# EasyEDA Pro project MSDriver(Ver2.0).eprj

# Schematic Schematic1
Board Name: Board1; Create Date: 2025-01-27; Page Name: P1; Project Name: MSDriver(Ver2.0); Schematic Name: Schematic1; Update Date: 2025-03-01; Company: 嘉立创EDA; Page Size: A4; Version: V1.0
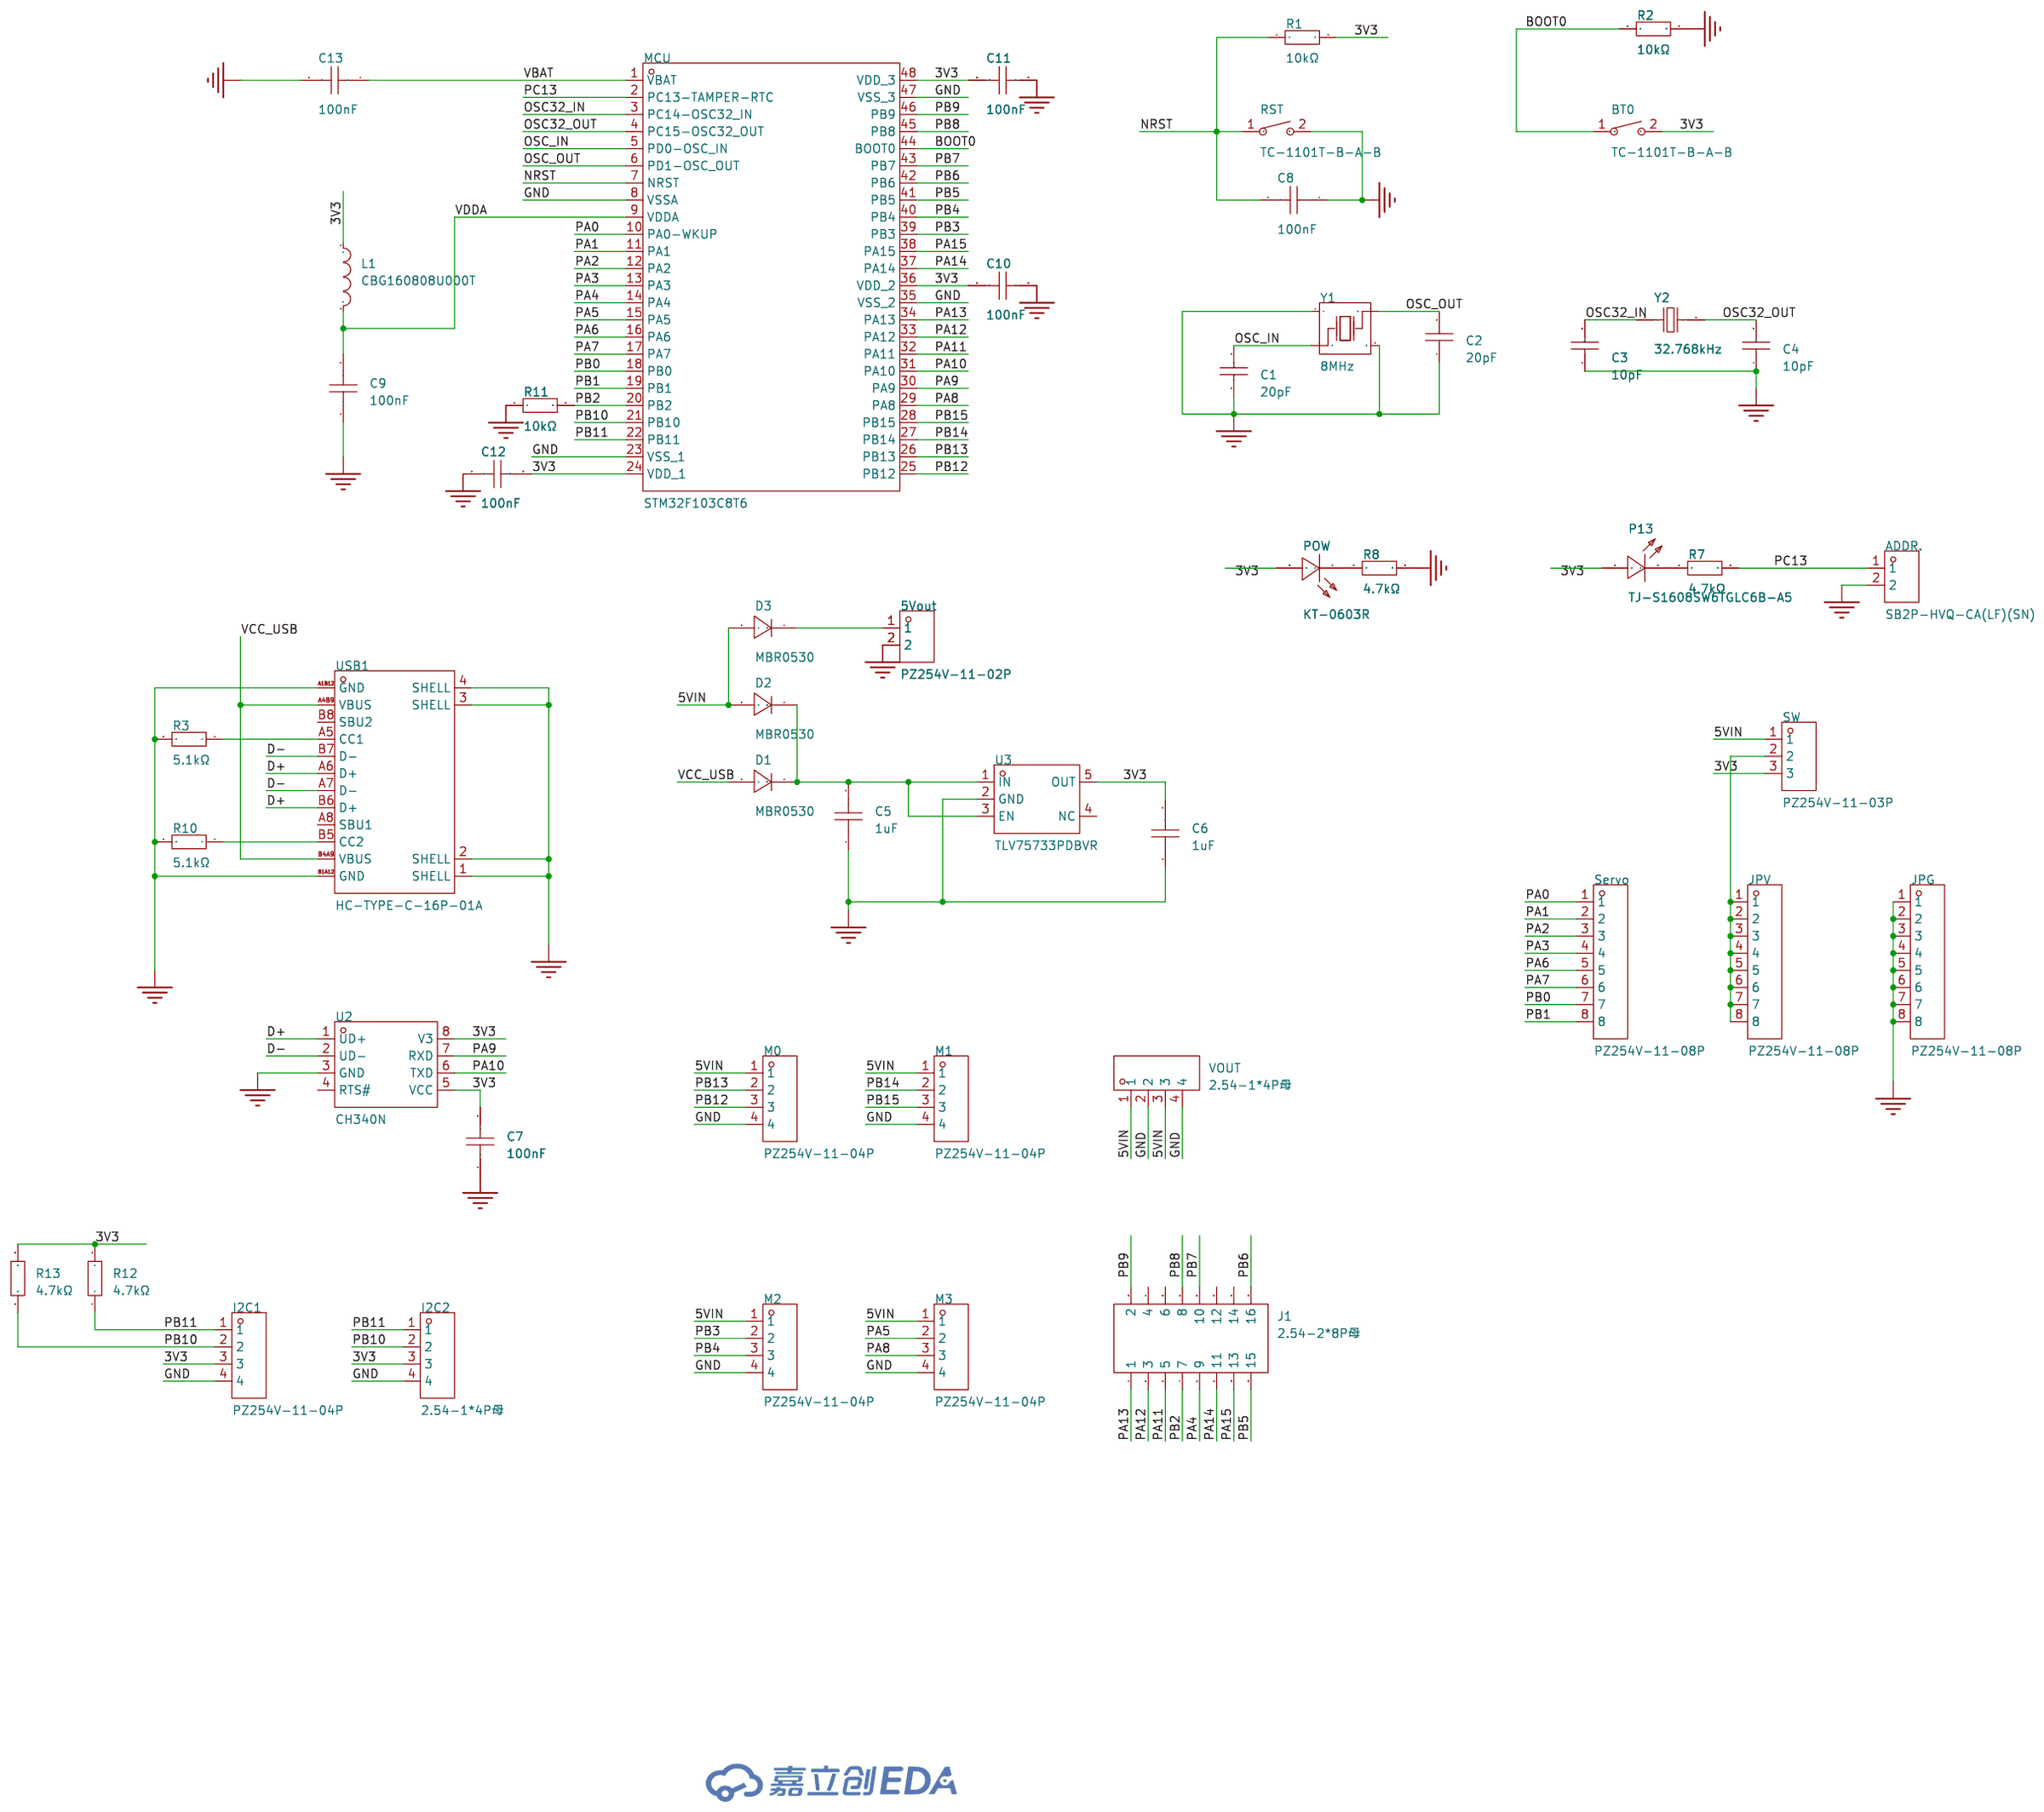
[diagram p0: schematic sheet]

## Parts
5Vout  PZ254V-11-02P  [HDR-TH_2P-P2.54-V-M]
ADDR.  SB2P-HVQ-CA(LF)(SN)  [HDR-TH_2P-P2.54-V-M-1]
BT0  TC-1101T-B-A-B  [KEY-TH_2P-L6.0-W3.5-P6.50]
C1  20pF  [C0603]
C2  20pF  [C0603]
C3  10pF  [C0603]
C4  10pF  [C0603]
C5  1uF  [C0603]
C6  1uF  [C0603]
C7  100nF  [C0603]
C8  100nF  [C0603]
C9  100nF  [C0603]
C10  100nF  [C0603]
C11  100nF  [C0603]
C12  100nF  [C0603]
C13  100nF  [C0603]
D1  MBR0530  [SOD-123_L2.8-W1.8-LS3.7-RD]
D2  MBR0530  [SOD-123_L2.8-W1.8-LS3.7-RD]
D3  MBR0530  [SOD-123_L2.8-W1.8-LS3.7-RD]
I2C1  PZ254V-11-04P  [HDR-TH_4P-P2.54-V-M]
I2C2  2.54-1*4P母  [HDR-TH_4P-P2.54-V-F]
J1  2.54-2*8P母  [HDR-TH_16P-P2.54-V-F-R2-C8-S2.54]
JPG  PZ254V-11-08P  [HDR-TH_8P-P2.54-V-M]
JPV  PZ254V-11-08P  [HDR-TH_8P-P2.54-V-M]
L1  CBG160808U000T  [L0603]
M0  PZ254V-11-04P  [HDR-TH_4P-P2.54-V-M]
M1  PZ254V-11-04P  [HDR-TH_4P-P2.54-V-M]
M2  PZ254V-11-04P  [HDR-TH_4P-P2.54-V-M]
M3  PZ254V-11-04P  [HDR-TH_4P-P2.54-V-M]
MCU  STM32F103C8T6  [LQFP-48_L7.0-W7.0-P0.50-LS9.0-BL]
P13  TJ-S1608SW6TGLC6B-A5  [LED0603-R-RD_BLUE]
POW  KT-0603R  [LED0603-RD]
R1  10kΩ  [R0603]
R2  10kΩ  [R0603]
R3  5.1kΩ  [R0603]
R7  4.7kΩ  [R0603]
R8  4.7kΩ  [R0603]
R10  5.1kΩ  [R0603]
R11  10kΩ  [R0603]
R12  4.7kΩ  [R1206]
R13  4.7kΩ  [R1206]
RST  TC-1101T-B-A-B  [KEY-TH_2P-L6.0-W3.5-P6.50]
Servo  PZ254V-11-08P  [HDR-TH_8P-P2.54-V-M]
SW  PZ254V-11-03P  [HDR-TH_3P-P2.54-V-M]
U2  CH340N  [SOP-8_L4.9-W3.9-P1.27-LS6.0-BL]
U3  TLV75733PDBVR  [SOT-23-5_L2.9-W1.6-P0.95-LS2.8-BL]
USB1  HC-TYPE-C-16P-01A  [USB-C-SMD_HC-TYPE-C-16P-01A]
VOUT  2.54-1*4P母  [HDR-TH_4P-P2.54-V-F]
Y1  8MHz  [CRYSTAL-SMD_4P-L3.2-W2.5-BL]
Y2  32.768kHz  [FC-135R_L3.2-W1.5]

## Library data of the parts
5Vout = PZ254V-11-02P: LCSC Part Name: 间距:2.54mm 1x2P 直插 方针; Supplier Part: C492401; Manufacturer: XFCN(兴飞); Supplier Footprint: 插件,P=2.54mm; JLCPCB Part Class: 扩展库; Datasheet: https://atta.szlcsc.com/upload/public/pdf/source/20200309/C492401_A812433581A9B211A7FFA413ADDFF0E5.pdf; Supplier: LCSC; Pin Structure: 1x2P; Pitch: 2.54mm; Circluar Pins/Square Pins: 方针; Mounting Type: 直插; Number of Rows: 单排; Number of Pins: 2P; Length of Mating Pin: 6mm; Insulation Height: 2.5mm; Length of End Connection Pin: 3mm; Contact Material: 黄铜; Operating Temperature Range: -40℃~+105℃; Color: 黑色
ADDR. = SB2P-HVQ-CA(LF)(SN): LCSC Part Name: 间距:2.5mm 1x2P 直插; Supplier Part: C157909; Manufacturer: JST; Supplier Footprint: 插件,P=2.5mm; JLCPCB Part Class: 扩展库; Datasheet: https://atta.szlcsc.com/upload/public/pdf/source/20180319/2518302FDF705D922213CC841EAA9FB0.pdf; Supplier: LCSC; Pin Structure: 1x2P; Pitch: 2.5mm; Mounting Type: 直插; Number of Rows: 单排; Number of Pins: 2P; Length of Mating Pin: 7.5mm; Insulation Height: 3.3mm; Length of End Connection Pin: 3.4mm; Contact Material: 黄铜; Operating Temperature Range: -25℃~+85℃; Color: 白色
BT0 RST = TC-1101T-B-A-B: LCSC Part Name: 6*3.5*4.3mm 直插 轻触开关; Supplier Part: C500069; Manufacturer: XKB Connectivity(中国星坤); Supplier Footprint: 插件; JLCPCB Part Class: 扩展库; Datasheet: https://atta.szlcsc.com/upload/public/pdf/source/20211011/B69A8CD93B4DADD1FF98516D35420DE2.pdf; Supplier: LCSC; Circuit: 单刀单掷; Actuator Style: 矩形按钮; Operating Force: 160gf; Mounting Style: 直插; Switch Length: 6mm; Switch Width: 3.5mm; Switch Height: 4.3mm; Strike Gundam: 不带; Contact Current: 50mA; Voltage Rating (DC): 12V; Actuator/Cap Color: 黑色; With Lamp: 无; Pin Style: PC引脚; Mechanical Life: 5万次; Operating Temperature: -20℃~+70℃
C1 C2 = CL10C200JB8NNNC: LCSC Part Name: 20pF ±5% 50V; Supplier Part: C1648; Manufacturer: SAMSUNG(三星); Supplier Footprint: 0603; JLCPCB Part Class: 基础库; Datasheet: https://atta.szlcsc.com/upload/public/pdf/source/20160218/1457707763339.pdf; Supplier: LCSC; Tolerance: ±5%; Voltage Rated: 50V; Temperature Coefficient: C0G
C3 C4 = CL10C100JB8NNNC: LCSC Part Name: 10pF ±5% 50V; Supplier Part: C1634; Manufacturer: SAMSUNG(三星); Supplier Footprint: 0603; JLCPCB Part Class: 基础库; Datasheet: https://atta.szlcsc.com/upload/public/pdf/source/20160218/1457707763339.pdf; Supplier: LCSC; Tolerance: ±5%; Voltage Rated: 50V; Temperature Coefficient: C0G
C5 C6 = CL10A105KB8NNNC: LCSC Part Name: 1uF ±10% 50V; Supplier Part: C15849; Manufacturer: SAMSUNG(三星); Supplier Footprint: 0603; JLCPCB Part Class: 基础库; Datasheet: https://atta.szlcsc.com/upload/public/pdf/source/20160218/1457707763339.pdf; Supplier: LCSC; Tolerance: ±10%; Voltage Rated: 50V; Temperature Coefficient: X5R
C7-C13 = CGA0603X7R104K500JT: LCSC Part Name: 100nF ±10% 50V; Supplier Part: C6119867; Manufacturer: HRE(芯声); Supplier Footprint: 0603; JLCPCB Part Class: 扩展库; Supplier: LCSC; Tolerance: ±10%; Voltage Rated: 50V; Temperature Coefficient: X7R
D1-D3 = MBR0530_C77336: LCSC Part Name: 电压:30V 电流:500mA; Supplier Part: C77336; Manufacturer: CJ(江苏长电/长晶); Supplier Footprint: SOD-123; JLCPCB Part Class: 扩展库; Datasheet: https://atta.szlcsc.com/upload/public/pdf/source/20160702/1467448303432.pdf; Supplier: LCSC; Forward Voltage (Vf@If): 550mV@500mA; Reverse Voltage (Vr): 30V; Rectified Current: 500mA
I2C1 M0-M3 = PZ254V-11-04P: LCSC Part Name: 间距:2.54mm 1x4P 直插 方针; Supplier Part: C2691448; Manufacturer: XFCN(兴飞); Supplier Footprint: 插件,P=2.54mm; JLCPCB Part Class: 扩展库; Datasheet: https://atta.szlcsc.com/upload/public/pdf/source/20200309/C492403_F9F19131791D08044AD4F84F8E751A34.pdf; Supplier: LCSC; Pin Structure: 1x4P; Pitch: 2.54mm; Circluar Pins/Square Pins: 方针; Mounting Type: 直插; Number of Rows: 单排; Number of Pins: 4P; Current Rating (Max): 3A; Voltage Rating (Max): 250V; Length of Mating Pin: 6mm; Insulation Height: 2.5mm; Length of End Connection Pin: 3mm; Operating Temperature Range: -40℃~+105℃; Color: 黑色
I2C2 VOUT = 2.54-1*4P母: LCSC Part Name: 间距:2.54mm 1x4P 直插; Supplier Part: C2718488; Manufacturer: BOOMELE(博穆精密); Supplier Footprint: 插件,P=2.54mm; JLCPCB Part Class: 扩展库; Datasheet: https://atta.szlcsc.com/upload/public/pdf/source/20210301/C2718488_F4427B881E42CAA8DDB0B1C12B3A522C.pdf; Supplier: LCSC; Holes Structure: 1x4P; Pitch: 2.54mm; Circular Hole / Square Hole: 方孔; Mounting Type: 直插; Number of Rows: 单排; Number of Holes: 4P; Current Rating (Max): 3A; Holes Direction: 顶部; Contact Material: 青铜; Operating Temperature Range: -40℃~+105℃
J1 = 2.54-2*8P母: LCSC Part Name: 间距:2.54mm 2x8P 直插; Supplier Part: C30734; Manufacturer: BOOMELE(博穆精密); Supplier Footprint: 插件,P=2.54mm; JLCPCB Part Class: 扩展库; Datasheet: https://atta.szlcsc.com/upload/public/pdf/source/20230817/400B44B2F3F98035DBB6B63900A9163B.pdf; Supplier: LCSC; Holes Structure: 2x8P; Pitch: 2.54mm; Row Spacing: 2.54mm; Mounting Type: 直插; Number of Rows: 双排; Number of Holes: 16P; Contact Material: 黄铜
JPG JPV Servo = PZ254V-11-08P: LCSC Part Name: 间距:2.54mm 1x8P 直插 方针; Supplier Part: C492407; Manufacturer: XFCN(兴飞); Supplier Footprint: 插件,P=2.54mm; JLCPCB Part Class: 扩展库; Datasheet: https://atta.szlcsc.com/upload/public/pdf/source/20200309/C492407_83A6FB26A2233368EDB9516968EC6149.pdf; Supplier: LCSC; Pin Structure: 1x8P; Pitch: 2.54mm; Circluar Pins/Square Pins: 方针; Mounting Type: 直插; Number of Rows: 单排; Number of Pins: 8P; Length of Mating Pin: 6mm; Insulation Height: 2.5mm; Length of End Connection Pin: 3mm; Contact Material: 黄铜; Operating Temperature Range: -40℃~+105℃; Color: 黑色
L1 = CBG160808U000T: LCSC Part Name: 单路 0603磁珠 阻抗0Ω@100MHz; Supplier Part: C43163; Manufacturer: FH(风华); Supplier Footprint: 0603; JLCPCB Part Class: 扩展库; Datasheet: https://atta.szlcsc.com/upload/public/pdf/source/20190129/C361667_1614D407CC98D1D3CFBD9E1F7511C14D.pdf; Supplier: LCSC; Impedance @ Frequency: 0Ω@100MHz; DC Resistance: 100mΩ; Current Rating: 800mA; Circuits: 1
MCU = STM32F103C8T6: LCSC Part Name: 主流增强型ARM Cortex-M3 MCU，具有64 KB Flash、72 MHz CPU、电机控制、USB和CAN; Supplier Part: C8734; Manufacturer: ST(意法半导体); Supplier Footprint: LQFP-48(7x7); JLCPCB Part Class: 扩展库; Datasheet: https://atta.szlcsc.com/upload/public/pdf/source/20220812/8363ACEC51AD55ECEB84799464F7CB85.pdf; Supplier: LCSC; CPU Core: ARM-M3; CPU Maximum Speed: 72MHz; Program Storage Size: 64KB; Program Memory Type: FLASH; Number of I/O: 37; ADC (Bit): 12bit; Low Voltage Detection Threshold: 2V~3.6V
P13 = TJ-S1608SW6TGLC6B-A5: LCSC Part Name: 蓝灯; Supplier Part: C192317; Manufacturer: TOGIALED(统佳); Supplier Footprint: 0603; JLCPCB Part Class: 扩展库; Datasheet: https://atta.szlcsc.com/upload/public/pdf/source/20180531/C192317_AA13A08FB08D946F89A6CA6E91343921.pdf; Supplier: LCSC; Emitted Color: 蓝色; Power Dissipation: 111mW; Forward Current: 20mA; Dominant Wavelength: 460nm; Peak Wavelength: 465nm; Lens Color: 无色透明透镜; Viewing Angle: 120°; Operating Temperature: -40℃~+80℃
POW = KT-0603R: LCSC Part Name: 0603 红灯 高亮; Supplier Part: C2286; Manufacturer: KENTO; Supplier Footprint: 0603; JLCPCB Part Class: 基础库; Datasheet: https://atta.szlcsc.com/upload/public/pdf/source/20160616/1466072038404.pdf; Supplier: LCSC; Emitted Color: 红色; Operating Temperature: -40℃~+85℃
R1 R2 R11 = 0603WAF1002T5E: LCSC Part Name: 厚膜电阻 10kΩ ±1% 100mW; Supplier Part: C25804; Manufacturer: UNI-ROYAL(厚声); Supplier Footprint: 0603; JLCPCB Part Class: Basic Part; Datasheet: https://atta.szlcsc.com/upload/public/pdf/source/20200306/C422600_1E6D84923E4A46A82E41ADD87F860B5C.pdf; Supplier: LCSC; Type: 厚膜电阻; Tolerance: ±1%; Power(Watts): 100mW; Overload Voltage (Max): 75V; Temperature Coefficient: ±100ppm/℃; Operating Temperature Range: -55℃~+155℃
R3 R10 = 0603WAF5101T5E: LCSC Part Name: 5.1kΩ ±1% 100mW 厚膜电阻; Supplier Part: C23186; Manufacturer: UNI-ROYAL(厚声); Supplier Footprint: 0603; JLCPCB Part Class: Basic Part; Datasheet: https://atta.szlcsc.com/upload/public/pdf/source/20200306/C422600_1E6D84923E4A46A82E41ADD87F860B5C.pdf; Supplier: LCSC; Type: 厚膜电阻; Tolerance: ±1%; Power(Watts): 100mW; Overload Voltage (Max): 75V; Temperature Coefficient: ±100ppm/℃; Operating Temperature Range: -55℃~+155℃
R7 R8 = 0603WAF4701T5E: LCSC Part Name: 4.7kΩ ±1% 100mW 厚膜电阻; Supplier Part: C23162; Manufacturer: UNI-ROYAL(厚声); Supplier Footprint: 0603; JLCPCB Part Class: Basic Part; Datasheet: https://atta.szlcsc.com/upload/public/pdf/source/20200306/C422600_1E6D84923E4A46A82E41ADD87F860B5C.pdf; Supplier: LCSC; Type: 厚膜电阻; Tolerance: ±1%; Power(Watts): 100mW; Overload Voltage (Max): 75V; Temperature Coefficient: ±100ppm/℃; Operating Temperature Range: -55℃~+155℃
R12 R13 = 1206W4F4701T5E: LCSC Part Name: 4.7kΩ ±1% 250mW 厚膜电阻; Supplier Part: C17936; Manufacturer: UNI-ROYAL(厚声); Supplier Footprint: 1206; JLCPCB Part Class: 基础库; Datasheet: https://atta.szlcsc.com/upload/public/pdf/source/20200306/C422600_1E6D84923E4A46A82E41ADD87F860B5C.pdf; Supplier: LCSC; Type: 厚膜电阻; Tolerance: ±1%; Power(Watts): 250mW; Overload Voltage (Max): 200V; Temperature Coefficient: ±100ppm/℃; Operating Temperature Range: -55℃~+155℃
SW = PZ254V-11-03P: LCSC Part Name: 间距:2.54mm 1x3P 直插 方针; Supplier Part: C2937625; Manufacturer: XFCN(兴飞); Supplier Footprint: 插件,P=2.54mm; JLCPCB Part Class: 扩展库; Datasheet: https://atta.szlcsc.com/upload/public/pdf/source/20200309/C492402_8335C3D49C4E4C618838D59BB1D024C1.pdf; Supplier: LCSC; Pin Structure: 1x3P; Pitch: 2.54mm; Circluar Pins/Square Pins: 方针; Mounting Type: 直插; Number of Rows: 单排; Number of Pins: 3P; Current Rating (Max): 3A; Voltage Rating (Max): 250V; Length of Mating Pin: 6mm; Insulation Height: 2.5mm; Length of End Connection Pin: 3mm; Operating Temperature Range: -40℃~+105℃; Color: 黑色
U2 = CH340N: LCSC Part Name: USB转串口芯片CH340; Supplier Part: C2977777; Manufacturer: WCH(南京沁恒); Supplier Footprint: SOP-8; JLCPCB Part Class: 扩展库; Datasheet: https://atta.szlcsc.com/upload/public/pdf/source/20240313/115CDE92081B1D6CB446704AD5D0F5F2.pdf; Supplier: LCSC; Applications Function: USB转串口; Protocol: USB 2.0; Number of Channels: 1; Supply Voltage: 3.3V；5V; Data Rate: 2Mbps; Operating Temperature: -20℃~+70℃
U3 = TLV75733PDBVR: LCSC Part Name: 具有使能功能的 1A、低 IQ、高精度、低压降稳压器; Supplier Part: C485517; Manufacturer: TI(德州仪器); Supplier Footprint: SOT-23-5; JLCPCB Part Class: 扩展库; Datasheet: https://www.ti.com/cn/lit/gpn/tlv757p; Supplier: LCSC; Output Type: 固定; Maximum Input Voltage: 5.5V; Output Voltage: 3.3V; Output Current: 1A; Power Supply Rejection Ratio (PSRR): 52dB; Dropout Voltage: 475mV@(1A); Feature: 防静电保护；浪涌保护；低ESR；热保护(TSD)；欠压闭锁；过流保护(OCP)；带使能; Operating Temperature: -40℃~+125℃@(Tj); Output Polarity: 正极; Number of Outputs: 1
USB1 = HC-TYPE-C-16P-01A: LCSC Part Name: Type-C 母 卧贴; Supplier Part: C2894897; Manufacturer: HCTL(华灿天禄); Supplier Footprint: SMD; JLCPCB Part Class: 扩展库; Datasheet: https://atta.szlcsc.com/upload/public/pdf/source/20221116/CF1C0058359F0761D6F7BB69303000BD.pdf; Supplier: LCSC; Connector Type: Type-C; Gender: 母; Mounting Style: 卧贴; Number of Contacts: 16P; Number of Ports: 1; Current Rating - Power (Max): 5A; Contact Material: 铜; Contact Plating: 金; Operating Temperature Range: -55℃~+85℃; Soldering Temperature(Max): 260℃
Y1 = TAXM8M4RDBCCT2T: LCSC Part Name: 8MHz ±10ppm 10pF; Supplier Part: C400090; Manufacturer: YJX(雅晶鑫); Supplier Footprint: SMD3225-4P; JLCPCB Part Class: 扩展库; Datasheet: https://atta.szlcsc.com/upload/public/pdf/source/20190626/C400090_CF95B89E745AFE4EF2E392EF8AC009D6.pdf; Supplier: LCSC; Crystal Type: 贴片晶振; Normal temperature Frequency Tolerance: ±10ppm; Load Capacitor: 10pF; Frequency Stability(Full temperature range): ±15ppm; Equivalent Series Resistance (ESR): 250Ω; Operating Temperature: -40℃~+85℃
Y2 = Q13FC13500004_C32346: LCSC Part Name: 32.768kHz ±20ppm 12.5pF; Supplier Part: C32346; Manufacturer: EPSON(爱普生); Manufacturer Part: Q13FC13500004; Supplier Footprint: SMD3215-2P; JLCPCB Part Class: 基础库; Datasheet: https://atta.szlcsc.com/upload/public/pdf/source/20240418/0E0FF5F0356BA3753F616001439D1416.pdf; Supplier: LCSC; Crystal Type: 贴片晶振; Normal temperature Frequency Tolerance: ±20ppm; Load Capacitor: 12.5pF; Equivalent Series Resistance (ESR): 70kΩ; Operating Temperature: -40℃~+85℃

## Nets
3V3: BT0.2 C6.2 C7.2 C10.1 C11.1 C12.2 I2C1.3 I2C2.3 L1.1 MCU.24(VDD_1) MCU.36(VDD_2) MCU.48(VDD_3) P13.1(A) POW.2(A) R1.2 R12.2 R13.2 SW.3 U2.5(VCC) U2.8(V3) U3.5(OUT)
5VIN: D2.2(A) D3.2(A) M0.1 M1.1 M2.1 M3.1 SW.1 VOUT.1 VOUT.3
GND: 5Vout.2 ADDR..2 C1.1 C2.1 C3.1 C4.1 C5.1 C6.1 C7.1 C8.1 C9.1 C10.2 C11.2 C12.1 C13.2 I2C1.4 I2C2.4 JPG.1 JPG.2 JPG.3 JPG.4 JPG.5 JPG.6 JPG.7 JPG.8 M0.4 M1.4 M2.4 M3.4 MCU.8(VSSA) MCU.23(VSS_1) MCU.35(VSS_2) MCU.47(VSS_3) R2.2 R3.2 R8.2 R10.2 R11.1 RST.2 U2.3(GND) U3.2(GND) USB1.1(SHELL) USB1.2(SHELL) USB1.3(SHELL) USB1.4(SHELL) USB1.A1B12(GND) USB1.B1A12(GND) VOUT.2 VOUT.4 Y1.2 Y1.4
VBAT: C13.1 MCU.1(VBAT)
VCC_USB: D1.2(A) USB1.A4B9(VBUS) USB1.B4A9(VBUS)
VDDA: C9.2 L1.2 MCU.9(VDDA)
BOOT0: BT0.1 MCU.44(BOOT0) R2.1
D+: U2.1(UD+) USB1.A6(D+) USB1.B6(D+)
D-: U2.2(UD-) USB1.A7(D-) USB1.B7(D-)
NRST: C8.2 MCU.7(NRST) R1.1 RST.1
OSC32_IN: C3.2 MCU.3(PC14-OSC32_IN) Y2.1
OSC32_OUT: C4.2 MCU.4(PC15-OSC32_OUT) Y2.2
OSC_IN: C1.2 MCU.5(PD0-OSC_IN) Y1.1
OSC_OUT: C2.2 MCU.6(PD1-OSC_OUT) Y1.3
PA0: MCU.10(PA0-WKUP) Servo.1
PA1: MCU.11(PA1) Servo.2
PA2: MCU.12(PA2) Servo.3
PA3: MCU.13(PA3) Servo.4
PA4: J1.9 MCU.14(PA4)
PA5: M3.2 MCU.15(PA5)
PA6: MCU.16(PA6) Servo.5
PA7: MCU.17(PA7) Servo.6
PA8: M3.3 MCU.29(PA8)
PA9: MCU.30(PA9) U2.7(RXD)
PA10: MCU.31(PA10) U2.6(TXD)
PA11: J1.5 MCU.32(PA11)
PA12: J1.3 MCU.33(PA12)
PA13: J1.1 MCU.34(PA13)
PA14: J1.11 MCU.37(PA14)
PA15: J1.13 MCU.38(PA15)
PB0: MCU.18(PB0) Servo.7
PB1: MCU.19(PB1) Servo.8
PB2: J1.7 MCU.20(PB2) R11.2
PB3: M2.2 MCU.39(PB3)
PB4: M2.3 MCU.40(PB4)
PB5: J1.15 MCU.41(PB5)
PB6: J1.16 MCU.42(PB6)
PB7: J1.10 MCU.43(PB7)
PB8: J1.8 MCU.45(PB8)
PB9: J1.2 MCU.46(PB9)
PB10: I2C1.2 I2C2.2 MCU.21(PB10) R13.1
PB11: I2C1.1 I2C2.1 MCU.22(PB11) R12.1
PB12: M0.3 MCU.25(PB12)
PB13: M0.2 MCU.26(PB13)
PB14: M1.2 MCU.27(PB14)
PB15: M1.3 MCU.28(PB15)
PC13: ADDR..1 MCU.2(PC13-TAMPER-RTC) R7.2
$1N3000: C5.2 D1.1(C) D2.1(C) U3.1(IN) U3.3(EN)
$1N4992: POW.1(K) R8.1
$1N5076: P13.2(K) R7.1
$1N6359: R10.1 USB1.B5(CC2)
$1N6363: R3.1 USB1.A5(CC1)
$1N11196: JPV.1 JPV.2 JPV.3 JPV.4 JPV.5 JPV.6 JPV.7 JPV.8 SW.2
$1N25739: 5Vout.1 D3.1(C)

Not connected (* = marked no-connect by the designer): J1 4 6 12 14; U2 4(RTS#); U3 4(NC); USB1 A8(SBU1) B8(SBU2)

# Board PCB2.1
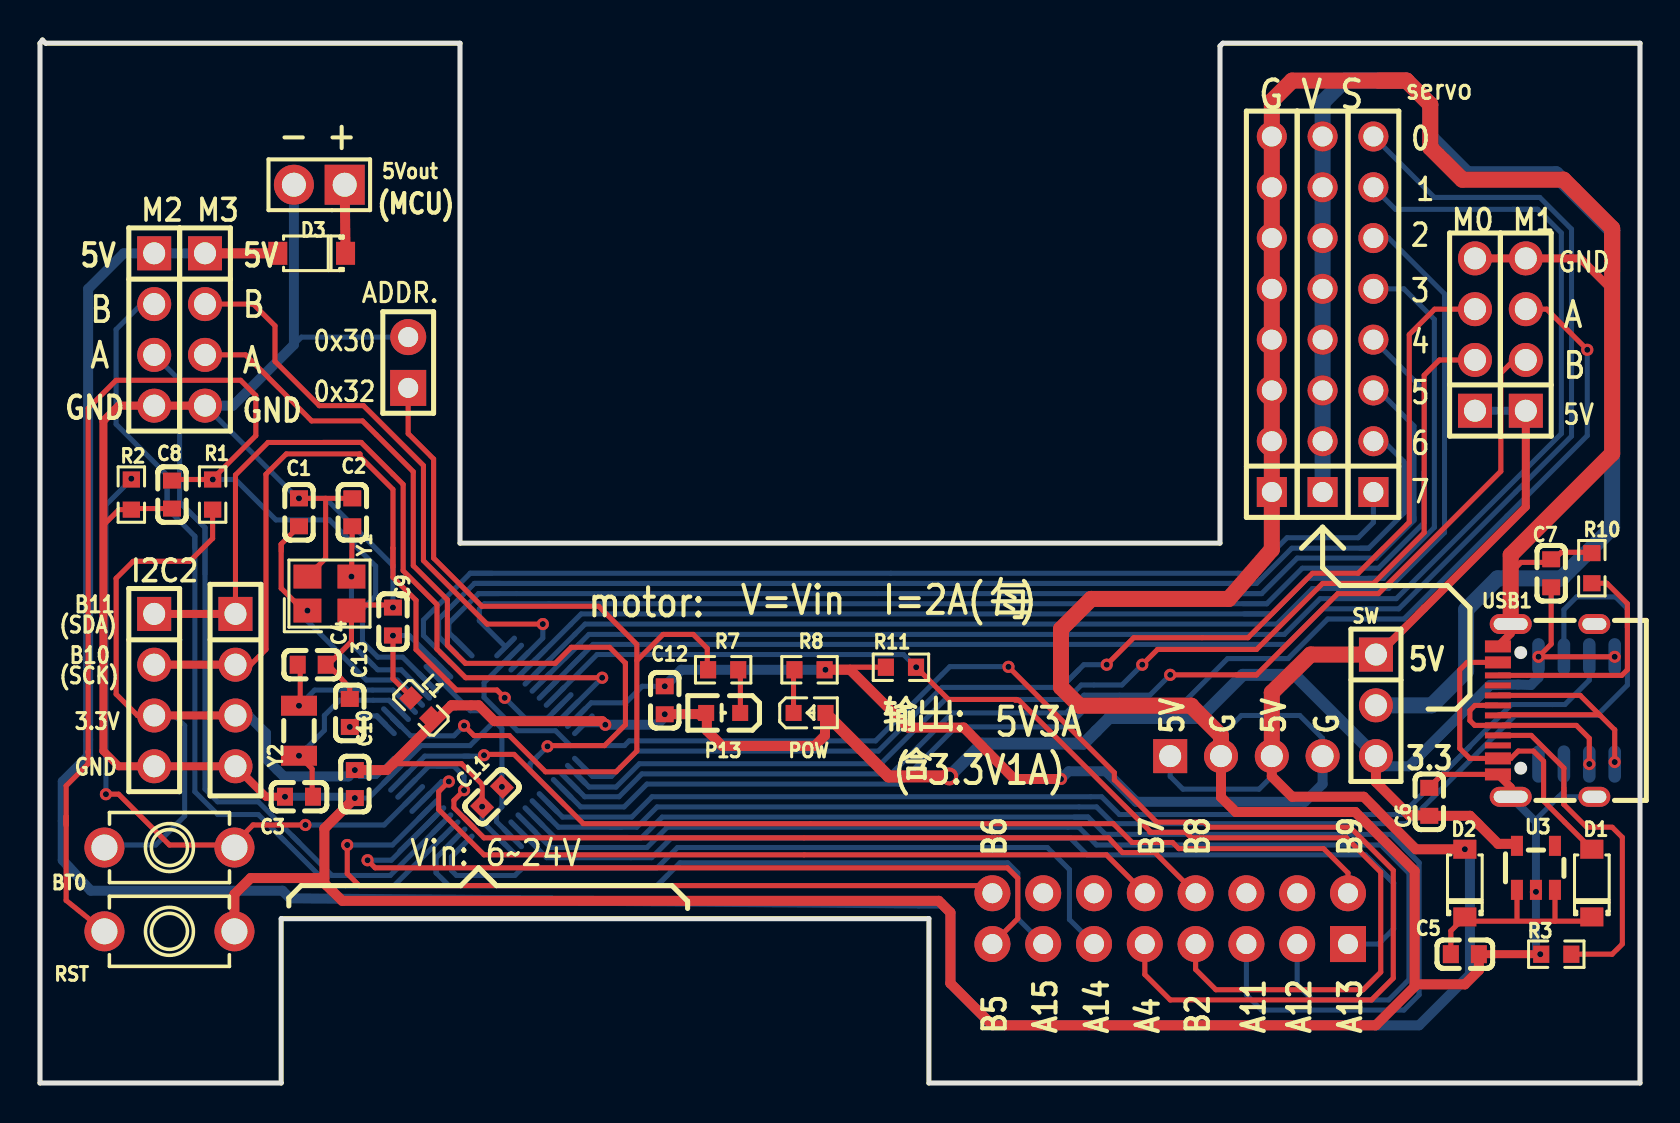
[diagram p1: board, top side]
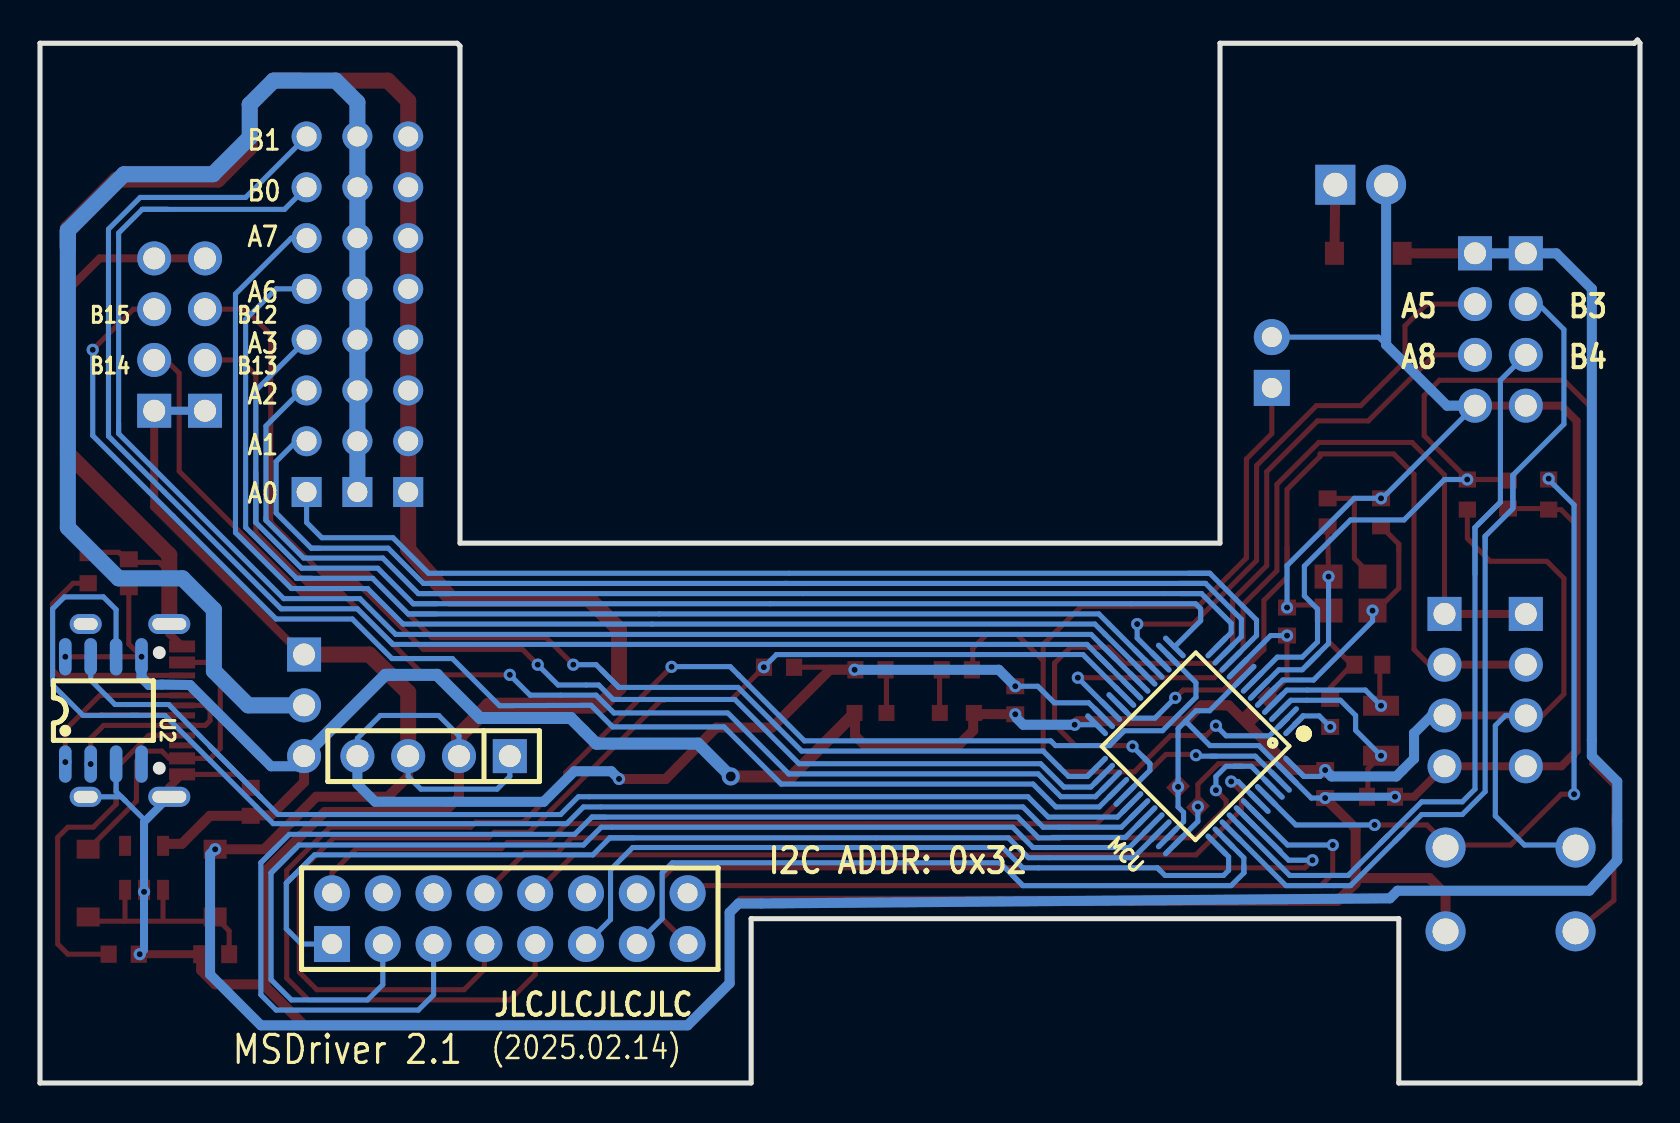
[diagram p2: board, bottom side, seen from below]

Outline 80 x 52.16 mm; copper layers: Top Layer, Bottom Layer. Coordinates in mm from the lower left corner of the outline.
Outline path: 0,52 0,0 12.06,0 12.06,8.22 44.44,8.22 44.44,0 80,0 80,52 59.14,52 59,51.86 59,27 21,27 21,52 0.28,52 0.12,52.16 0,52
Stack: Top Layer 0.035mm / Dielectric1 1.51mm FR4 er 4.5 / Bottom Layer 0.035mm

## Design rules (mm)
template: JLCPCB Capability(Two Layers Board)
spacing copperThickness1oz (default): track to track 0.102, other pairs 0.152 to 0.3
spacing copperThickness2oz: track to track 0.203, other pairs 0.152 to 0.3
track width copperThickness1oz (default): min 0.127, default 0.254, max 2.54
track width copperThickness2oz: min 0.203, default 0.254, max 2.54
differential pair differentialPair (default): width min 0.127, default 0.254, max 2.54; gap min 0.152, default 0.152
via viaSize (default): diameter min 0.5, default 0.61, max 10; hole min 0.3, default 0.305, max 6.3

## Placement (name value [footprint] x y rotation side)
5Vout  PZ254V-11-02P  [HDR-TH_2P-P2.54-V-M]  13.97 44.92 180 top
ADDR.  SB2P-HVQ-CA(LF)(SN)  [HDR-TH_2P-P2.54-V-M-1]  18.41 36.03 90 top
BT0  TC-1101T-B-A-B  [KEY-TH_2P-L6.0-W3.5-P6.50]  6.47 11.78 180 top
C1  20pF  [C0603]  12.95 28.54 270 top
C2  20pF  [C0603]  15.62 28.54 270 top
C3  10pF  [C0603]  12.95 14.32 0 top
C4  10pF  [C0603]  13.58 20.92 180 top
C5  1uF  [C0603]  71.24 6.44 180 top
C6  1uF  [C0603]  69.46 14.06 270 top
C7  100nF  [C0603]  75.56 25.49 270 top
C8  100nF  [C0603]  6.6 29.43 90 top
C9  100nF  [C0603]  17.65 23.08 270 top
C10  100nF  [C0603]  15.74 14.95 270 top
C11  100nF  [C0603]  22.6 14.32 45 top
C12  100nF  [C0603]  31.24 19.14 270 top
C13  100nF  [C0603]  15.49 18.51 90 top
D1  MBR0530  [SOD-123_L2.8-W1.8-LS3.7-RD]  77.59 10 90 top
D2  MBR0530  [SOD-123_L2.8-W1.8-LS3.7-RD]  71.24 10 90 top
D3  MBR0530  [SOD-123_L2.8-W1.8-LS3.7-RD]  13.58 41.49 180 top
I2C1  PZ254V-11-04P  [HDR-TH_4P-P2.54-V-M]  5.71 19.65 270 top
I2C2  2.54-1*4P母  [HDR-TH_4P-P2.54-V-F]  9.77 19.65 270 top
J1  2.54-2*8P母  [HDR-TH_16P-P2.54-V-F-R2-C8-S2.54]  56.51 8.22 180 bottom
JPG  PZ254V-11-08P  [HDR-TH_8P-P2.54-V-M]  61.59 38.45 90 top
JPV  PZ254V-11-08P  [HDR-TH_8P-P2.54-V-M]  64.13 38.45 90 top
L1  CBG160808U000T  [L0603]  19.04 18.76 135 top
M0  PZ254V-11-04P  [HDR-TH_4P-P2.54-V-M]  71.75 37.43 90 top
M1  PZ254V-11-04P  [HDR-TH_4P-P2.54-V-M]  74.29 37.43 90 top
M2  PZ254V-11-04P  [HDR-TH_4P-P2.54-V-M]  5.71 37.68 270 top
M3  PZ254V-11-04P  [HDR-TH_4P-P2.54-V-M]  8.25 37.68 270 top
MCU  STM32F103C8T6  [LQFP-48_L7.0-W7.0-P0.50-LS9.0-BL]  22.22 16.86 45 bottom
P13  TJ-S1608SW6TGLC6B-A5  [LED0603-R-RD_BLUE]  34.16 18.51 180 top
POW  KT-0603R  [LED0603-RD]  38.48 18.51 0 top
R1  10kΩ  [R0603]  8.63 29.43 270 top
R2  10kΩ  [R0603]  4.57 29.43 270 top
R3  5.1kΩ  [R0603]  75.81 6.44 180 top
R7  4.7kΩ  [R0603]  34.16 20.67 180 top
R8  4.7kΩ  [R0603]  38.48 20.67 0 top
R10  5.1kΩ  [R0603]  77.59 25.75 90 top
R11  10kΩ  [R0603]  43.05 20.79 0 top
RST  TC-1101T-B-A-B  [KEY-TH_2P-L6.0-W3.5-P6.50]  6.47 7.59 0 top
Servo  PZ254V-11-08P  [HDR-TH_8P-P2.54-V-M]  66.67 38.45 90 top
SW  PZ254V-11-03P  [HDR-TH_3P-P2.54-V-M]  66.8 18.89 270 top
U2  CH340N  [SOP-8_L4.9-W3.9-P1.27-LS6.0-BL]  76.83 18.63 180 bottom
U3  TLV75733PDBVR  [SOT-23-5_L2.9-W1.6-P0.95-LS2.8-BL]  74.8 10.76 0 top
USB1  HC-TYPE-C-16P-01A  [USB-C-SMD_HC-TYPE-C-16P-01A]  75.31 18.63 90 top
VOUT  2.54-1*4P母  [HDR-TH_4P-P2.54-V-F]  60.32 16.35 0 bottom
Y1  8MHz  [CRYSTAL-SMD_4P-L3.2-W2.5-BL]  14.47 24.48 0 top
Y2  32.768kHz  [FC-135R_L3.2-W1.5]  12.95 17.62 90 top

## Footprints (pads in the part's own frame, mm; a bottom-side part is the same pattern mirrored in y, then rotated)
C0603
  rect 0.8x0.9 smd: 1(-0.7,0) 2(0.7,0)
CRYSTAL-SMD_4P-L3.2-W2.5-BL
  rect 1.4x1.2 smd: 1(-1.1,-0.85) 2(1.1,-0.85) 3(1.1,0.85) 4(-1.1,0.85)
FC-135R_L3.2-W1.5
  rect 1x1.8 smd: 1(-1.25,0) 2(1.25,0)
HDR-TH_2P-P2.54-V-M
  rect 2x2 hole 1.2: 1(-1.27,0)
  round 2 hole 1.2: 2(1.27,0)
HDR-TH_2P-P2.54-V-M-1
  rect 1.8x1.8 hole 1: 1(-1.27,0)
  round 1.8 hole 1: 2(1.27,0)
HDR-TH_3P-P2.54-V-M
  rect 1.7x1.7 hole 1.1: 1(-2.54,0)
  round 1.7 hole 1.1: 2(0,0) 3(2.54,0)
HDR-TH_4P-P2.54-V-F
  rect 1.7x1.7 hole 1.1: 1(-3.81,0)
  round 1.7 hole 1.1: 2(-1.27,0) 3(1.27,0) 4(3.81,0)
HDR-TH_4P-P2.54-V-M
  rect 1.7x1.7 hole 1.1: 1(-3.81,0)
  round 1.7 hole 1.1: 2(-1.27,0) 3(1.27,0) 4(3.81,0)
HDR-TH_8P-P2.54-V-M
  rect 1.5x1.5 hole 1: 1(-8.89,0)
  round 1.5 hole 1: 2(-6.35,0) 3(-3.81,0) 4(-1.27,0) 5(1.27,0) 6(3.81,0) 7(6.35,0) 8(8.89,0)
HDR-TH_16P-P2.54-V-F-R2-C8-S2.54
  rect 1.8x1.8 hole 1: 1(-8.89,-1.27)
  round 1.8 hole 1: 2(-8.89,1.27) 3(-6.35,-1.27) 4(-6.35,1.27) 5(-3.81,-1.27) 6(-3.81,1.27) 7(-1.27,-1.27) 8(-1.27,1.27) 9(1.27,-1.27) 10(1.27,1.27) 11(3.81,-1.27) 12(3.81,1.27) 13(6.35,-1.27) 14(6.35,1.27) 15(8.89,-1.27) 16(8.89,1.27)
KEY-TH_2P-L6.0-W3.5-P6.50
  round 2 hole 1.3: 1(-3.25,0) 2(3.25,0)
L0603
  rect 0.8x0.864 smd: 1(-0.7,0) 2(0.7,0)
LED0603-R-RD_BLUE
  rect 0.8x0.8 smd: 1(0.851,0) 2(-0.851,0)
LED0603-RD
  rect 0.8x0.8 smd: 1(-0.799,0) 2(0.799,0)
LQFP-48_L7.0-W7.0-P0.50-LS9.0-BL
  oval 0.27x1.5 smd: 1(-2.75,-4.25) 2(-2.25,-4.25) 3(-1.75,-4.25) 4(-1.25,-4.25) 5(-0.75,-4.25) 6(-0.25,-4.25) 7(0.25,-4.25) 8(0.75,-4.25) 9(1.25,-4.25) 10(1.75,-4.25) 11(2.25,-4.25) 12(2.75,-4.25) 25(2.75,4.25) 26(2.25,4.25) 27(1.75,4.25) 28(1.25,4.25) 29(0.75,4.25) 30(0.25,4.25) 31(-0.25,4.25) 32(-0.75,4.25) 33(-1.25,4.25) 34(-1.75,4.25) 35(-2.25,4.25) 36(-2.75,4.25)
  oval 1.5x0.27 smd: 13(4.25,-2.75) 14(4.25,-2.25) 15(4.25,-1.75) 16(4.25,-1.25) 17(4.25,-0.75) 18(4.25,-0.25) 19(4.25,0.25) 20(4.25,0.75) 21(4.25,1.25) 22(4.25,1.75) 23(4.25,2.25) 24(4.25,2.75) 37(-4.25,2.75) 38(-4.25,2.25) 39(-4.25,1.75) 40(-4.25,1.25) 41(-4.25,0.75) 42(-4.25,0.25) 43(-4.25,-0.25) 44(-4.25,-0.75) 45(-4.25,-1.25) 46(-4.25,-1.75) 47(-4.25,-2.25) 48(-4.25,-2.75)
R0603
  rect 0.806x0.864 smd: 1(-0.753,0) 2(0.753,0)
SOD-123_L2.8-W1.8-LS3.7-RD
  rect 0.95x1.15 smd: 1(-1.692,0) 2(1.692,0)
SOP-8_L4.9-W3.9-P1.27-LS6.0-BL
  oval 0.63x1.865 smd: 1(-1.905,-2.683) 2(-0.635,-2.683) 3(0.635,-2.683) 4(1.905,-2.683) 5(1.905,2.683) 6(0.635,2.683) 7(-0.635,2.683) 8(-1.905,2.683)
SOT-23-5_L2.9-W1.6-P0.95-LS2.8-BL
  rect 0.6x1 smd: 1(-0.95,-1.1) 2(0,-1.1) 3(0.95,-1.1) 4(0.95,1.1) 5(-0.95,1.1)
USB-C-SMD_HC-TYPE-C-16P-01A
  oval 1x2.1 hole 0.6x1.7: 1(-4.32,1.77) 2(4.32,1.77)
  oval 1x1.6 hole 0.6x1.2: 3(4.32,-2.41) 4(-4.32,-2.41)
  rect 0.6x1.3 smd: A1B12(-3.2,2.41) A4B9(-2.4,2.41) B1A12(3.2,2.41) B4A9(2.4,2.41)
  rect 0.3x1.3 smd: A5(-1.25,2.41) A6(-0.25,2.41) A7(0.25,2.41) A8(1.25,2.41) B5(1.75,2.41) B6(0.75,2.41) B7(-0.75,2.41) B8(-1.75,2.41)

## Nets
3V3: BT0.2 C6.2 C7.2 C10.1 C11.1 C12.2 I2C1.3 I2C2.3 L1.1 MCU.24 MCU.36 MCU.48 P13.1 POW.2 R1.2 SW.3 U2.5 U2.8 U3.5
5VIN: D2.2 D3.2 M0.1 M1.1 M2.1 M3.1 SW.1 VOUT.1 VOUT.3
GND: 5Vout.2 ADDR..2 C1.1 C2.1 C3.1 C4.1 C5.1 C6.1 C7.1 C8.1 C9.1 C10.2 C11.2 C12.1 C13.2 I2C1.4 I2C2.4 JPG.1 JPG.2 JPG.3 JPG.4 JPG.5 JPG.6 JPG.7 JPG.8 M0.4 M1.4 M2.4 M3.4 MCU.8 MCU.23 MCU.35 MCU.47 R2.2 R3.2 R8.2 R10.2 R11.1 RST.2 U2.3 U3.2 USB1.1 USB1.2 USB1.3 USB1.4 USB1.A1B12 USB1.B1A12 VOUT.2 VOUT.4 Y1.2 Y1.4
VBAT: C13.1 MCU.1
VCC_USB: D1.2 USB1.A4B9 USB1.B4A9
VDDA: C9.2 L1.2 MCU.9
BOOT0: BT0.1 MCU.44 R2.1
D+: U2.1 USB1.A6 USB1.B6
D-: U2.2 USB1.A7 USB1.B7
NRST: C8.2 MCU.7 R1.1 RST.1
OSC32_IN: C3.2 MCU.3 Y2.1
OSC32_OUT: C4.2 MCU.4 Y2.2
OSC_IN: C1.2 MCU.5 Y1.1
OSC_OUT: C2.2 MCU.6 Y1.3
PA0: MCU.10 Servo.1
PA1: MCU.11 Servo.2
PA2: MCU.12 Servo.3
PA3: MCU.13 Servo.4
PA4: J1.9 MCU.14
PA5: M3.2 MCU.15
PA6: MCU.16 Servo.5
PA7: MCU.17 Servo.6
PA8: M3.3 MCU.29
PA9: MCU.30 U2.7
PA10: MCU.31 U2.6
PA11: J1.5 MCU.32
PA12: J1.3 MCU.33
PA13: J1.1 MCU.34
PA14: J1.11 MCU.37
PA15: J1.13 MCU.38
PB0: MCU.18 Servo.7
PB1: MCU.19 Servo.8
PB2: J1.7 MCU.20 R11.2
PB3: M2.2 MCU.39
PB4: M2.3 MCU.40
PB5: J1.15 MCU.41
PB6: J1.16 MCU.42
PB7: J1.10 MCU.43
PB8: J1.8 MCU.45
PB9: J1.2 MCU.46
PB10: I2C1.2 I2C2.2 MCU.21
PB11: I2C1.1 I2C2.1 MCU.22
PB12: M0.3 MCU.25
PB13: M0.2 MCU.26
PB14: M1.2 MCU.27
PB15: M1.3 MCU.28
PC13: ADDR..1 MCU.2 R7.2
$1N3000: C5.2 D1.1 D2.1 U3.1 U3.3
$1N4992: POW.1 R8.1
$1N5076: P13.2 R7.1
$1N6359: R10.1 USB1.B5
$1N6363: R3.1 USB1.A5
$1N11196: JPV.1 JPV.2 JPV.3 JPV.4 JPV.5 JPV.6 JPV.7 JPV.8 SW.2
$1N25739: 5Vout.1 D3.1

Pads without a net: J1 4 6 12 14; U2 4; U3 4; USB1 A8 B8

## Via types
v1: diameter 0.61, hole 0.305, Top Layer to Bottom Layer, 45 vias
v2: diameter 0.9, hole 0.5, Top Layer to Bottom Layer, 1 via

## Routing (per net, layer and track width the routed paths; a pad name or vN(x,y) marks a point on that pad's centre or on a via; arc(x,y) is an arc through that point)
3V3: length 146.4
  Top Layer w0.254: I2C1.3 4.87,18.38 3.81,19.45 3.81,25.24 4.66,26.09 7.49,26.09 8.63,27.23 8.63,28.63 ; 17.65,15.97 21.08,15.97 22.11,14.94 v1(22.11,13.82) ; 75.56,25.01 75.56,21.95 v1(74.93,21.32) v1(78.74,21.32)
  Top Layer w0.4: I2C1.3 I2C2.3
  Top Layer w0.5: v1(15.74,15.65) 17.33,15.65 20.57,18.89 ; 20.57,18.89 20.82,18.89 ; 20.57,18.89 21.93,18.89 22.72,18.1 28.11,18.1 28.29,17.92 ; v1(31.24,18.44) 33.34,18.45 ; 33.34,18.45 33.01,18.38 ; 33.34,18.45 33.34,17.62 34.11,16.86 38.73,16.86 39.25,17.38 39.25,18.51 ; SW.3 66.8,15.05 68.46,13.38 69.44,13.38 C6.2 71.5,13.36 71.96,12.91 ; 71.82,13.05 72.91,11.96 73.85,11.96
  Top Layer w0.6: 39.25,18.51 42.43,15.33 v2(45.46,15.33)
  Bottom Layer w0.254: I2C1.3 6.73,18.38 7.23,17.87 7.23,13.36 5.78,11.9 3.22,11.9 ; 15.87,15.46 16,15.33 16.81,15.33 MCU.48 ; v1(22.11,13.82) 22.11,13.08 MCU.36 ; MCU.24 28.29,17.92
  Bottom Layer w0.5: I2C2.3 10.41,18.38 11.3,17.49 ; 11.3,17.49 11.3,16.22 ; 11.3,17.49 11.3,16.22 ; 11.3,16.22 12.19,15.33 15.42,15.33 v1(15.74,15.65) ; v1(28.27,17.92) 30.84,17.92 31.17,18.25 ; 66.67,15.84 68.45,15.84 72.51,19.9 ; 72.51,19.9 68.96,16.35 ; 72.51,19.9 73.9,19.93 74.54,19.9 74.93,20.28 v1(74.93,21.32)
  Bottom Layer w0.6: v2(45.46,15.33) 47.1,16.97 52.18,16.97 ; 52.06,16.98 52.19,16.98 53.46,18.25 57.99,18.25 ; 57.99,18.25 57.53,18.25 ; 57.99,18.25 60.15,20.41 ; 62.61,20.41 60.13,20.41 ; 62.31,20.41 62.73,20.41 SW.3
5VIN: length 169.6
  Top Layer w0.4: 66.67,20.92 66.67,21.19 74.29,28.81 M1.1
  Top Layer w0.5: M3.1 D3.2 ; VOUT.3 61.59,15.33 62.61,14.32 66.19,14.32 68.79,11.69 70.99,11.69
  Top Layer w0.8: VOUT.3 61.59,19.53 63.53,21.43 SW.1
  Bottom Layer w0.254: VOUT.1 56.51,15.33 57.15,14.7 60.96,14.7 61.59,15.33 VOUT.3
  Bottom Layer w0.4: M0.1 M1.1
  Bottom Layer w0.5: M3.1 4.19,41.49 2.41,39.72 2.41,16.35 1.14,15.08 1.14,11.14 2.53,9.62 12.12,9.62 12.51,9.24 43.93,8.98 45.07,8.98 45.51,8.54 ; 45.52,8.53 45.52,4.99 47.62,2.89 68.96,2.89 71.5,5.43 71.5,11.44 v1(71.24,11.69)
GND: length 390.7
  Top Layer w0.254: 3.17,27.9 3.95,28.68 R2.2 4.62,28.73 C8.1 ; 14.28,29.24 14.28,26.24 Y1.4 ; 15.49,18.95 15.49,19.77 14.41,20.92 15.57,22.08 Y1.2 ; C2.1 v1(12.95,29.24) ; 16,24.03 16.12,23.91 17.9,23.91 ; v1(39.27,20.67) 39.4,20.79 42.25,20.79 ; 48.38,15.46 48.64,15.2 v1(51.05,15.2) ; 69.49,14.82 70.11,15.43 72.96,15.43 ; 73.51,25.49 74.05,26.04 75.56,26.04 76.06,26.54 77.59,26.54
  Top Layer w0.4: M3.4 M2.4 3.93,33.87 3.17,33.11 3.17,16.6 3.93,15.84 I2C2.4 11.3,14.32 v1(12.25,14.32) ; M0.4 77.02,41.24 78.61,39.65 ; C5.1 v1(75.01,6.44) ; USB1.B1A12 73.54,22.47 USB1.2 ; USB1.A1B12 73.54,14.79 73.54,14.22
  Top Layer w0.5: RST.2 9.72,9.44 10.53,10.25 14.22,10.25 ; v1(15.74,14.25) 14.22,12.73 14.22,9.98 15.12,9.11 44.94,9.11 45.52,8.53 45.52,4.99 47.62,2.89 66.79,2.89 68.73,4.83 68.73,10.6 65.76,13.55 59.79,13.55 59.05,14.3 VOUT.2 ; R8.2 40.51,20.67 43.4,17.78 46.19,17.78 48.71,15.2 v1(51.05,15.2) ; 68.73,4.93 71.24,4.93 71.94,5.63 C5.1
  Top Layer w0.8: 57.57,18.87 51.97,18.87 51.05,19.79 51.05,22.7 52.56,24.21 59.44,24.21 61.59,26.68 JPG.1 61.59,49.11 62.61,50.13 68.32,50.13 ; 57.55,18.87 59.05,17.37 VOUT.2 ; 68.32,50.13 66.93,50.13 ; 68.32,50.13 69.51,48.94 69.51,46.78 71.12,45.18 76.18,45.18 78.61,42.74 78.61,40.64 ; USB1.2 73.54,26.41 78.61,31.48 78.61,42.64
  Bottom Layer w0.254: M3.4 12.88,29.24 v1(12.95,29.24) ; 12.95,29.3 13.01,29.24 14.28,29.24 17.65,25.87 v1(17.65,23.78) ; 12.03,36.26 13.08,37.3 ADDR..2 ; v1(15.74,14.25) 16.43,14.25 MCU.47 19.06,16.87 21.5,16.87 22.72,18.1 ; 19.82,20.32 21.52,18.62 22.2,18.62 23.1,17.72 v1(23.1,14.81) 23.1,13.81 22.82,13.53 22.82,13.07 23.61,12.29 23.61,12.26 ; 26.75,18.2 27.56,19.02 29.28,19.02 30.11,19.84 v1(31.24,19.84) ; VOUT.2 59.05,17.36 60.07,18.38 62.99,18.38 64.13,17.24 VOUT.4 ; 73.72,14.13 USB1.1 ; 74.8,13.05 74.8,13.18 75.75,14.13 ; 75.75,14.13 75.93,14.31 USB1.4 ; 75.75,14.13 76.19,14.58 U2.3
  Bottom Layer w0.4: v1(12.25,14.32) 15.68,14.32 v1(15.74,14.25) ; USB1.1 74.8,13.05 v1(74.8,9.56) 74.8,6.66 v1(75.01,6.44)
  Bottom Layer w0.5: M3.4 9.65,33.87 12.69,36.92 5Vout.2 ; v1(31.24,19.84) 32.06,20.67 R8.2 ; v1(51.05,15.2) 51.44,15.59 53.29,15.59 54.82,14.06 63.24,14.06 64.13,14.95 VOUT.4
VBAT: length 2.2
  Bottom Layer w0.254: v1(15.49,17.81) 16.04,18.36 16.85,18.36 17.27,17.94 MCU.1
VDDA: length 6.5
  Top Layer w0.254: v1(17.65,22.38) 17.65,20.22 18.54,19.33
  Bottom Layer w0.254: 17.65,22.38 18.46,22.38 20.1,20.75
BOOT0: length 34.2
  Top Layer w0.254: v1(3.3,14.44) 3.93,14.44 6.47,11.9 9.72,11.9 ; 9.72,11.52 10.16,11.95 10.16,12.41 10.65,12.91 v1(13.27,12.91)
  Bottom Layer w0.254: v1(3.3,14.44) 3.3,28.91 R2.1 ; v1(13.27,12.91) 17.21,12.91 18.68,14.38
  vias: v1(4.57,30.22)
D+: length 13.2
  Top Layer w0.254: USB1.B6 77.01,19.38 78.01,18.38 ; 72.96,18.42 77.98,18.42 78.74,17.66 ; 78.74,17.68 v1(78.74,16.05)
D-: length 9.3
  Top Layer w0.254: 72.74,17.88 71.74,17.88 71.5,18.13 71.5,18.63 71.75,18.88 USB1.A7 ; 73.12,17.88 76.82,17.88 77.47,17.24 v1(77.47,15.95)
NRST: length 63
  Top Layer w0.254: RST.1 1.31,9.13 1.31,13.34 1.31,12.9 1.31,14.87 2.41,15.97 2.41,16.61 ; 2.41,16.53 2.41,33.75 3.81,35.14 10.03,35.14 10.79,34.38 10.79,32.37 8.64,30.22 ; C8.2 6.65,30.18 v1(8.64,30.18)
  Bottom Layer w0.254: 8.63,30.19 v1(8.64,30.18) 9.77,30.18 11.8,28.16 14.47,28.16 16.78,25.85 16.78,24.36 16.12,23.7 16.12,22.06 16.89,21.3 18.13,21.3 MCU.7
OSC32_IN: length 9.2
  Top Layer w0.254: v1(12.95,16.37) 13.61,15.71 13.61,14.32
  Bottom Layer w0.254: v1(12.95,16.37) 14.22,17.64 14.22,18.38 14.98,19.14 17.46,19.14 MCU.3
OSC32_OUT: length 8.2
  Top Layer w0.254: 13.01,20.92 13.01,18.93 v1(12.95,18.87)
  Bottom Layer w0.254: v1(12.95,18.87) 13.73,19.65 17.66,19.65 18.4,18.91
OSC_IN: length 13.2
  Top Layer w0.254: 12.06,26.95 12.06,26.61 ; 12.06,26.95 12.06,24.74 12.8,24.01 13.75,24.01 ; 12.06,26.95 C1.2
  Bottom Layer w0.254: v1(13.37,23.63) 13.37,23.1 16.32,20.16 17.86,20.16 18.68,19.33
OSC_OUT: length 11.2
  Top Layer w0.254: C2.2 v1(15.57,25.33)
  Bottom Layer w0.254: v1(15.57,25.33) 15.57,21.98 16.67,20.88 ; 16.08,21.47 16.89,20.67 18.06,20.67 19.11,19.61
PA4: length 75.6
  Top Layer w0.254: 48.41,20.82 53.72,15.52 53.72,15.16 55.83,13.05 58.21,13.05 58.47,12.79 65.5,12.79 67.66,10.63 67.66,5.24 66.58,4.16 ; J1.9 55.24,5.43 56.51,4.16 66.59,4.16
  Bottom Layer w0.254: MCU.14 22.2,20.02 22.2,19.29 23.87,17.62 25.78,17.62 26.52,16.87 29.22,16.87 29.46,17.11 41.78,17.11 45.49,20.82 48.41,20.82
  vias: v1(48.42,20.81)
PA5: length 29.7
  Top Layer w0.254: M3.2 10.66,38.95 11.75,37.87 11.75,36.09 13.97,33.87 16.18,33.87 19.17,30.88 19.17,26.13 22.35,22.95 v1(25.14,22.95)
  Bottom Layer w0.254: MCU.15 25.14,22.25 v1(25.14,22.95)
PA8: length 45.6
  Top Layer w0.254: M3.3 10.28,36.41 13.58,33.11 16.12,33.11 18.66,30.57 18.66,25.87 20.37,24.17 20.37,21.89 21.27,20.99 25.76,20.99 26.56,21.79 28.48,21.79 29.27,21 ; 25.38,16.87 28.23,16.87 29.27,17.92 29.27,21 ; 29.27,21 29.27,18.91 29.28,18.9
  Bottom Layer w0.254: 24.51,15.97 24.89,16.35 ; 24.51,15.97 v1(25.38,16.84) 25.38,16.87 ; 24.51,15.97 24.51,15.63 25.75,14.39
PB2: length 64.2
  Top Layer w0.254: v1(43.81,20.79) 45.42,19.18 48.84,19.18 ; 48.76,19.14 48.95,19.14 55.55,12.54 ; 55.48,12.54 57.29,12.54 57.57,12.26 65.32,12.26 67.04,10.55 67.04,5.54 66.16,4.66 58.8,4.66 57.78,5.68 J1.7
  Bottom Layer w0.254: 26.12,19.7 27.85,21.43 43.18,21.43 ; 43.18,21.43 41.53,21.43 ; 43.18,21.43 v1(43.81,20.79)
PB5: length 44
  Top Layer w0.254: v1(16.38,11.14) 16.76,10.76 48.37,10.76 48.89,10.24 48.89,8.22 J1.15
  Bottom Layer w0.254: v1(16.38,11.14) 17.57,11.14 19.69,13.26 ; 19.82,13.39 17.98,11.6 ; 47.11,6.95 J1.15
PB6: length 38.9
  Top Layer w0.254: v1(15.36,11.9) 15.36,10.47 15.96,9.87 47.24,9.87 J1.16
  Bottom Layer w0.254: v1(15.36,11.9) 17.62,11.9 MCU.42
PB7: length 40.4
  Top Layer w0.254: v1(20.44,15.08) 19.93,14.57 19.93,13.68 22.2,11.41 53.32,11.41 J1.10
  Bottom Layer w0.254: 19.11,14.1 20.09,15.08 v1(20.44,15.08)
PB8: length 45.3
  Top Layer w0.254: 21.7,12.76 20.7,13.77 20.7,14.14 v1(21.2,14.64) ; 21.2,13.26 22.2,12.26 53.43,12.26 54.12,11.52 55.75,11.52 J1.8
  Bottom Layer w0.254: MCU.45 19.44,15.84 20.32,15.84 ; 19.88,15.84 20.7,15.84 21.2,15.33 v1(21.2,14.64) 21.21,14.64
PB9: length 51.7
  Top Layer w0.254: 22.12,16.43 23.7,16.43 27.17,12.97 53.66,12.97 54.6,12.03 56.63,12.03 56.94,11.72 64.19,11.72 65.4,10.51 J1.2
  Bottom Layer w0.254: 18.05,15.16 19.24,16.35 21.46,16.35 ; 21.19,16.35 22.03,16.35 22.2,16.52
  vias: v1(22.2,16.39)
PB10: length 40.7
  Top Layer w0.254: I2C2.2 10.54,20.92 11.3,21.68 11.3,30.44 12.31,31.46 16,31.46 16,31.33 17.65,29.68 17.65,25.78 ; 17.64,26.77 17.65,26.76 17.65,25.29 18.8,24.14 18.8,21.68 20.82,19.65 22.85,19.65 v1(23.24,19.26)
  Top Layer w0.4: I2C1.2 I2C2.2
  Bottom Layer w0.254: 23.24,19.27 v1(23.24,19.26) 24.25,18.25 25.38,18.25 26.11,18.98
PB11: length 42.7
  Top Layer w0.254: 9.77,23.7 9.77,30.41 11.4,32.03 16.06,32.03 ; 16.06,32.03 14.14,32.03 ; 16.06,32.03 18.16,29.94 18.16,25.62 19.85,23.93 19.85,21.7 21.28,20.27 v1(28.11,20.27)
  Top Layer w0.4: I2C1.1 I2C2.1
  Bottom Layer w0.254: MCU.22 v1(28.11,20.27)
PB12: length 61.2
  Top Layer w0.254: v1(53.34,20.92) 54.69,22.27 60.4,22.27 63.62,25.49 65.91,25.49 68.46,28.05 68.46,37.43 69.73,38.7 M0.3
  Bottom Layer w0.254: MCU.25 27.63,15.33 28.57,15.33 29.84,16.6 41.92,16.6 45.1,19.78 51.06,19.78 51.94,20.67 ; 51.05,19.78 52.19,20.92 v1(53.34,20.92)
PB13: length 58.7
  Top Layer w0.254: v1(55.11,20.92) 55.88,21.68 60.83,21.68 64.13,24.98 66.67,24.98 69.21,27.52 69.21,35.4 69.97,36.16 M0.2
  Bottom Layer w0.254: MCU.26 27.46,14.8 28.8,14.8 29.97,15.97 42.04,15.97 45.26,19.18 51.34,19.18 52.06,19.9 54.1,19.9 v1(55.11,20.92)
PB14: length 61
  Top Layer w0.254: 59.81,20.41 60.83,20.41 ; 60.83,20.41 v1(56.51,20.41) ; 60.83,20.41 64.89,24.48 66.92,24.48 73.04,30.59 73.04,35.5 73.7,36.16 M1.2
  Bottom Layer w0.254: MCU.27 27.24,14.32 28.95,14.32 30.09,15.46 42.56,15.46 ; 42.56,15.46 42.55,15.46 ; 42.56,15.46 45.61,18.51 ; 45.65,18.51 51.3,18.51 52.19,19.4 55.49,19.4 v1(56.51,20.41)
PB15: length 67.5
  Top Layer w0.254: M1.3 75.33,38.7 v1(77.36,36.67)
  Bottom Layer w0.254: 26.11,14.73 27.04,13.81 29.21,13.81 30.35,14.95 42.94,14.95 45.8,17.81 51.37,17.81 52.45,18.89 57.02,18.87 59.38,21.23 62.4,21.23 64.38,23.21 68.19,23.21 77.36,32.38 v1(77.36,36.67)
PC13: length 46.3
  Top Layer w0.254: ADDR..1 18.41,32.48 19.68,31.21 19.68,26.25 22.09,23.84 27.94,23.84 29.84,21.94 29.84,16.6 28.8,15.56 25.28,15.56 23.47,17.38 21.7,17.38 v1(21.2,17.87) ; 29.84,21.12 31.15,22.43 32.66,22.43 33.36,21.74 33.36,20.88
  Bottom Layer w0.254: 18.02,17.85 17.62,18.24 MCU.2 18.53,17.36 20.7,17.36 v1(21.2,17.87)
VCC_USB: length 16.2
  Top Layer w0.254: 72.96,21.03 71.36,21.03 70.99,20.67 70.99,16.73 71.49,16.23 USB1.A4B9 73.54,16.23 73.91,16.6 74.67,16.6 75.18,16.09 75.18,14.1 D1.2
PA0: length 54.8
  Bottom Layer w0.254: 20.52,21.03 19.17,22.38 19.17,23.15 21.51,25.49 ; 21.51,25.49 60.57,25.49 62.35,27.27 65.91,27.27 66.67,28.03 Servo.1 ; 21.51,25.49 22.59,25.49
PA1: length 60
  Bottom Layer w0.254: MCU.11 19.93,22.32 19.93,23.19 21.72,24.98 ; 21.72,24.98 42.79,24.98 ; 21.72,24.98 23.03,24.98 ; 42.62,24.98 60.51,24.98 ; 59.48,24.98 60.83,24.98 62.59,26.75 66.43,26.75 ; 66.43,26.75 66,26.75 ; 66.43,26.75 68.19,28.51 68.19,31.08 67.18,32.1 Servo.2
PA2: length 62.1
  Bottom Layer w0.254: 21.23,21.73 20.44,22.52 20.44,22.99 21.93,24.48 ; 21.93,24.48 61.08,24.48 ; 21.93,24.48 22.97,24.48 ; 61.08,24.48 59.5,24.48 ; 61.08,24.48 62.86,26.25 66.82,26.25 68.7,28.14 68.7,28.29 ; Servo.3 66.92,34.64 68.7,32.86 68.7,28.25
PA3: length 65.4
  Bottom Layer w0.254: MCU.13 21.97,23.12 21.97,23.71 22.22,23.97 61.34,23.97 ; 61.34,23.97 60.15,23.97 ; 61.34,23.97 63.11,25.75 66.92,25.75 69.21,28.03 ; 69.21,28.03 69.21,30.57 ; 69.21,28.03 69.21,34.64 Servo.4
PA6: length 65.6
  Bottom Layer w0.254: 24.34,20.75 25.28,21.68 ; 24.52,20.92 27.06,23.46 61.59,23.46 ; 61.59,23.46 60.2,23.46 ; 61.59,23.46 63.37,25.24 67.19,25.24 ; 66.39,25.24 67.17,25.24 69.72,27.78 69.72,38.19 68.19,39.72 Servo.5
PA7: length 66.3
  Bottom Layer w0.254: 24.62,20.32 25.48,21.17 ; 24.69,20.39 27.26,22.95 61.84,22.95 63.62,24.73 67.43,24.73 70.23,27.52 70.23,39.46 67.43,42.26 Servo.6
PA9: length 60.6
  Bottom Layer w0.254: MCU.30 26.13,13.3 29.59,13.3 30.6,14.32 53.08,14.32 53.97,13.43 68.1,13.43 68.99,14.32 ; 68.99,14.32 71.49,16.81 ; 68.99,14.32 73.57,18.93 76.25,18.93 77.47,20.15 77.47,21.22
PA10: length 69.3
  Bottom Layer w0.254: MCU.31 25.93,12.79 29.08,12.79 ; 28.52,12.79 29.84,12.79 30.86,13.81 52.83,13.81 53.66,12.97 68.34,12.97 73.75,18.38 73.78,18.38 ; 73.75,18.38 75.46,18.38 ; 75.1,18.38 76.98,18.38 ; U2.6 76.19,23.68 76.83,24.31 78.77,24.31 79.37,23.71 79.37,19.9 77.85,18.38 76.82,18.38
PA11: length 66.6
  Bottom Layer w0.254: 24.69,13.32 25.73,12.28 29.39,12.28 ; 29.03,12.26 30.07,12.26 31.11,13.3 52.4,13.3 ; 52.4,13.3 51.71,13.3 ; 52.4,13.3 53.26,12.44 67.53,12.44 68.96,11.01 ; J1.5 60.32,4.41 61.08,3.65 68.19,3.65 68.96,4.41 68.96,11.01 ; 68.96,11.01 68.19,11.78
PA12: length 62.3
  Bottom Layer w0.254: 24.5,12.81 25.53,11.78 30.35,11.78 31.36,12.79 51.94,12.79 52.83,11.9 67.05,11.9 68.45,10.51 ; J1.3 62.86,4.92 63.62,4.16 67.43,4.16 68.45,5.17 68.45,10.51 ; 68.45,10.51 67.69,11.27 ; 68.45,10.51 67.18,11.78
PA13: length 54.5
  Bottom Layer w0.254: MCU.34 25.33,11.27 30.58,11.27 31.57,12.26 51.51,12.26 ; 51.51,12.26 50.31,12.26 ; 51.51,12.26 52.36,11.41 66.27,11.41 67.63,10.05 ; 66.92,10.76 67.69,10 ; 67.69,10 66.42,11.27 ; 67.69,10 67.69,7.71 66.92,6.95 J1.1
PA14: length 38
  Bottom Layer w0.254: MCU.37 20.57,11.32 20.57,10.63 20.82,10.38 23.74,10.38 24.12,10.76 ; 24.12,10.76 24,10.63 ; 24.12,10.76 30.86,10.76 31.87,11.78 50.37,11.78 51.47,10.67 51.47,8.18 J1.11
PA15: length 37.4
  Bottom Layer w0.254: 19.81,10.51 19.81,11.26 MCU.38 ; 19.81,10.51 19.81,10.88 ; 19.81,10.51 20.44,9.87 30.86,9.87 ; 30.86,9.87 31.36,10.38 ; 30.86,9.87 32,11.01 48.38,11.01 48.89,10.51 48.89,8.22 J1.13
PB0: length 79.2
  Bottom Layer w0.254: MCU.18 26.95,21.94 ; 26.24,21.23 27.44,22.43 62.22,22.43 64,24.22 67.81,24.22 76.07,32.48 76.07,32.98 ; Servo.7 67.77,43.69 74.89,43.69 ; 74.89,43.69 73.62,43.69 ; 74.89,43.69 76.07,42.51 76.07,32.6
PB1: length 79.7
  Bottom Layer w0.254: MCU.19 27.15,21.43 ; 26.47,20.76 27.65,21.94 62.35,21.94 ; 62.35,21.94 62.48,22.06 ; 62.35,21.94 64.13,23.71 67.94,23.71 76.58,32.35 76.58,42.7 74.99,44.29 69.72,44.29 Servo.8
PB3: length 45.2
  Bottom Layer w0.254: M2.2 5.08,38.95 3.81,37.68 3.81,32.95 6.36,30.4 ; 6.36,30.4 6.36,28.78 6.36,30.4 ; 6.36,28.73 7.74,27.34 ; 7.74,27.34 7.74,26.75 ; 7.74,27.34 7.74,14.57 8.89,13.43 10.92,13.43 12.26,12.09 ; 11.83,12.52 14.47,9.87 17.7,9.87 20.09,12.26
PB4: length 42.6
  Bottom Layer w0.254: M2.3 6.98,35.14 6.98,29.05 ; 6.98,29.05 8.12,27.91 ; 6.98,29.05 8.25,27.78 ; 8.25,27.78 8.25,25.44 ; 8.25,27.78 8.25,14.7 8.89,14.06 10.92,14.06 12.95,12.03 ; 12.62,12.36 14.6,10.38 ; 14.6,10.38 15.3,10.38 ; 14.6,10.38 17.51,10.38 20.1,12.97
$1N3000: length 11.6
  Top Layer w0.254: D2.1 70.54,7.61 C5.2 ; 71.5,8.09 77.6,8.09 77.59,8.19 77.59,8.56 ; 73.85,9.56 73.85,8.16 ; 75.75,9.56 75.75,8.09
$1N4992: length 2.2
  Top Layer w0.254: 37.71,20.67 37.68,20.63 POW.1
$1N5076: length 2.1
  Top Layer w0.254: 35.02,18.53 35.02,20.67
$1N6359: length 13
  Top Layer w0.254: USB1.B5 79.09,20.38 79.37,20.67 79.37,23.71 ; R10.1 78.35,24.99 79.37,23.97 79.37,22.76
$1N6363: length 18.3
  Top Layer w0.254: USB1.A5 74.56,17.38 76.19,15.75 76.19,13.94 ; 76.19,13.94 76.19,14.76 ; 76.19,13.94 77.34,12.79 78.61,12.79 79.12,12.28 79.12,6.95 78.61,6.44 76.61,6.44
$1N11196: length 71.5
  Bottom Layer w0.8: JPV.1 JPV.8 64.13,49.05 65.21,50.13 68.32,50.13 69.51,48.94 69.51,47.29 71.35,45.45 75.79,45.45 78.61,42.64 ; SW.2 69.59,18.89 71.31,20.6 71.31,23.67 72.87,25.24 76.07,25.24 78.61,27.78 78.61,42.64 ; 78.61,42.64 78.61,41.75
$1N25739: length 3.9
  Top Layer w0.5: 15.74,44.92 5Vout.1 D3.1

## Text on the board
Bottom Silkscreen Layer: B12 | B13 | B15 | B14 | B1 | B0 | A7 | A6 | A3 | A2 | A1 | A0 | (2025.02.14) | B3 | B4 | A5 | A8 | JLCJLCJLCJLC | I2C ADDR: 0x32 | MSDriver 2.1
Top Silkscreen Layer: (SDA) | (SCK) | B10 | B11 | 3.3V | GND | 0x30 | 0x32 | servo | 5V | (MCU) | 2 | 3 | 4 | 5 | 6 | 7 | 1 | 0 | B6 | B5 | A15 | A14 | A4 | B7 | B8 | B2 | G | A11 | A12 | B9 | A13 | 3.3 | Vin: 6~24V | B | A | G V S | - + | motor: | V=Vin | I=2A(  ) | ( 3.3V1A) | 5V3A | 每 | 含 | 输出:

# Board PCB2.2
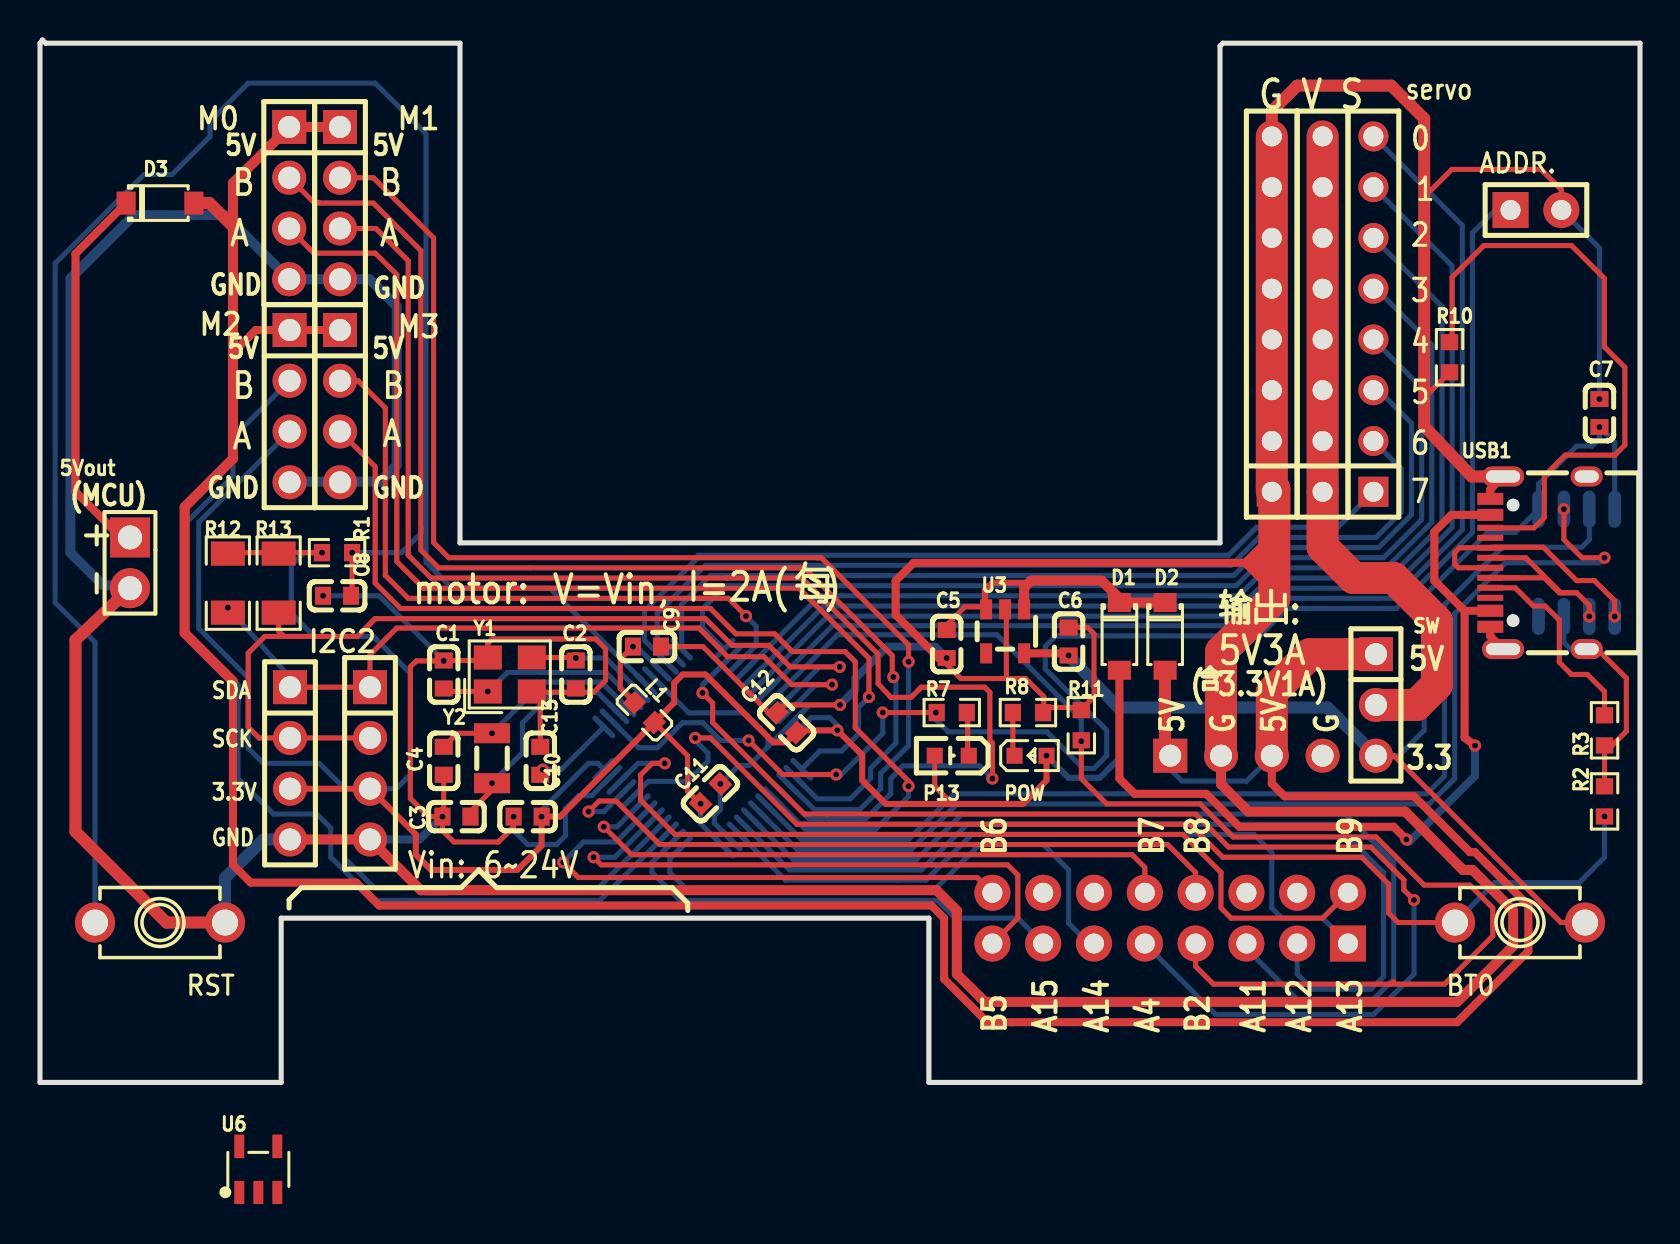
[diagram p3: board, top side]
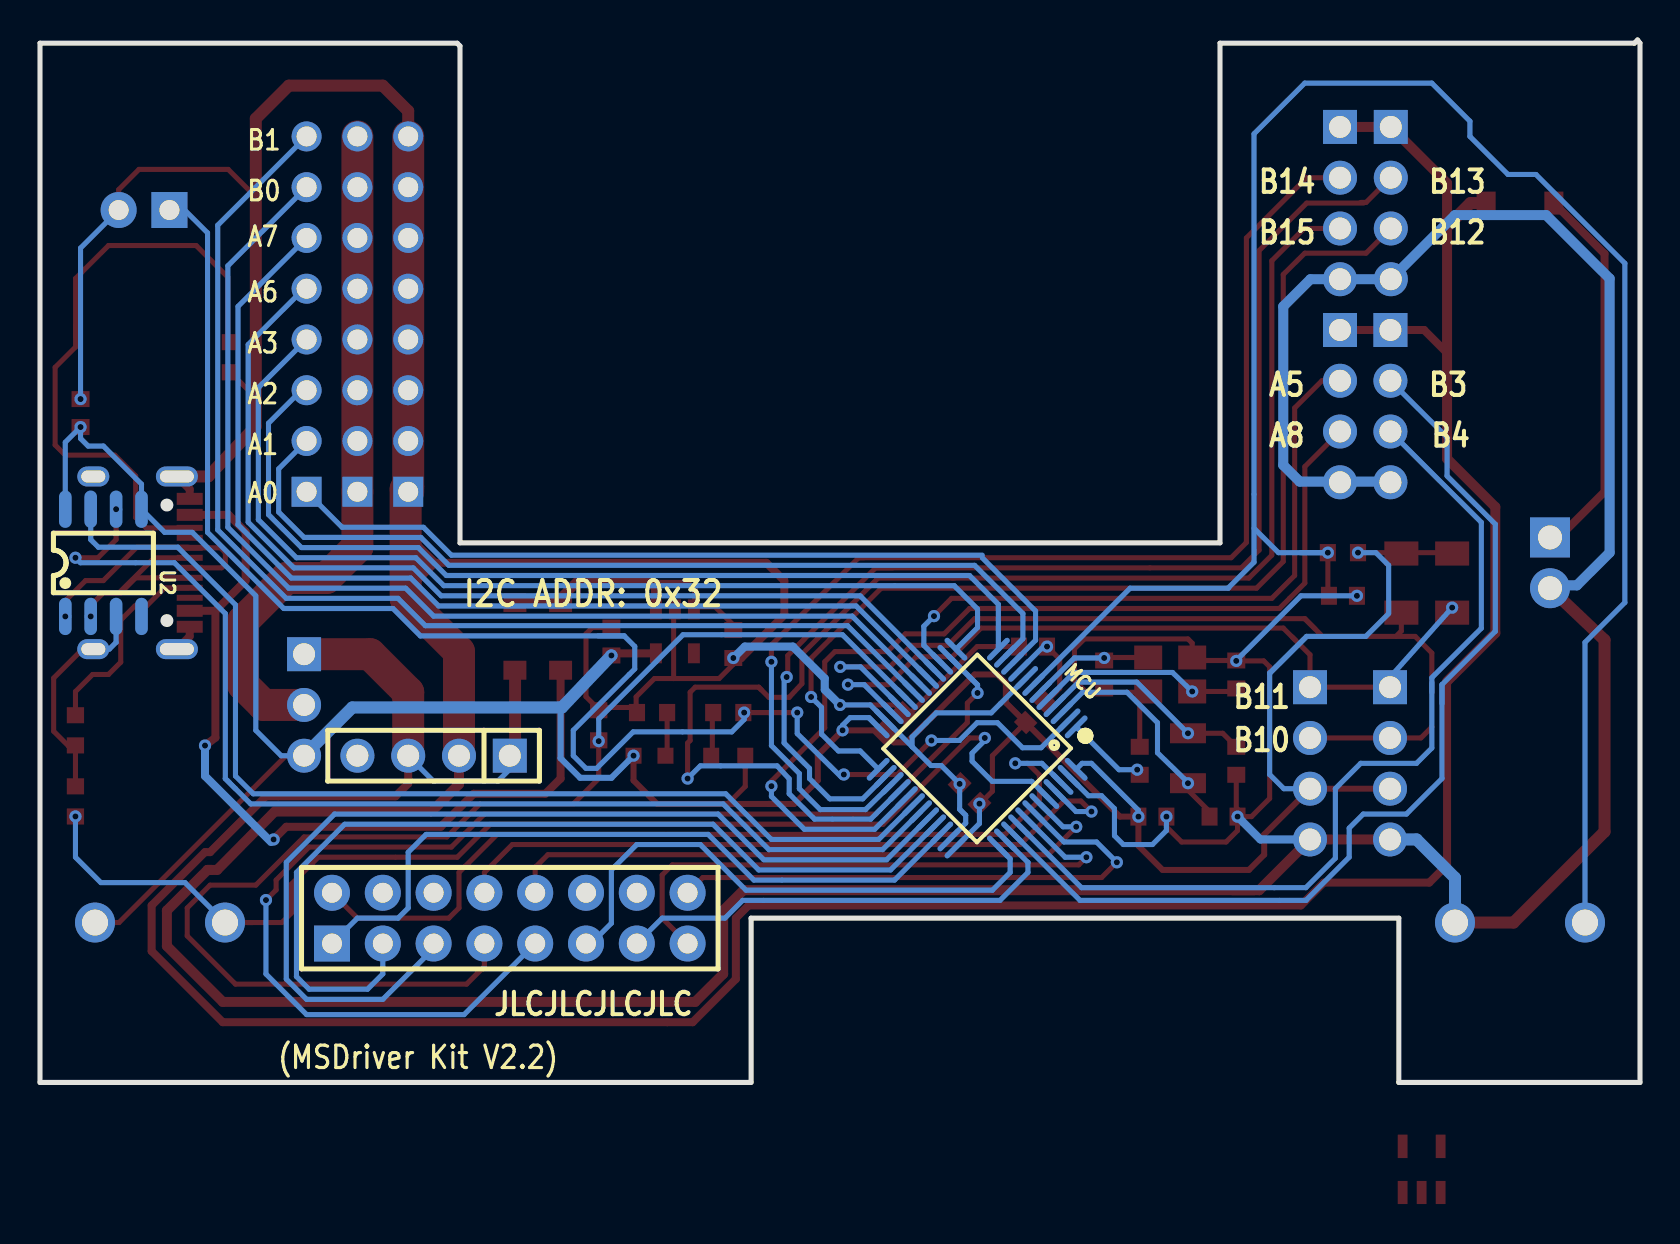
[diagram p4: board, bottom side, seen from below]

Outline 80 x 52.16 mm; copper layers: Top Layer, Bottom Layer. Coordinates in mm from the lower left corner of the outline.
Outline path: 0,52 0,0 12.06,0 12.06,8.22 44.44,8.22 44.44,0 80,0 80,52 59.14,52 59,51.86 59,27 21,27 21,52 0.28,52 0.12,52.16 0,52
Stack: Top Layer 0.035mm / Dielectric1 1.51mm FR4 er 4.5 / Bottom Layer 0.035mm

## Design rules (mm)
template: JLCPCB Capability(Two Layers Board)
spacing copperThickness1oz (default): track to track 0.102, other pairs 0.152 to 0.3
spacing copperThickness2oz: track to track 0.203, other pairs 0.152 to 0.3
track width copperThickness1oz (default): min 0.127, default 0.254, max 2.54
track width copperThickness2oz: min 0.203, default 0.254, max 2.54
differential pair differentialPair (default): width min 0.127, default 0.254, max 2.54; gap min 0.152, default 0.152
via viaSize (default): diameter min 0.5, default 0.61, max 10; hole min 0.3, default 0.305, max 6.3

## Placement (name value [footprint] x y rotation side)
5Vout  PZ254V-11-02P  [HDR-TH_2P-P2.54-V-M]  4.5 26 270 top
ADDR.  SB2P-HVQ-CA(LF)(SN)  [HDR-TH_2P-P2.54-V-M-1]  74.8 43.65 0 top
BT0  TC-1101T-B-A-B  [KEY-TH_2P-L6.0-W3.5-P6.50]  74 8 0 top
C1  20pF  [C0603]  20.19 20.41 270 top
C2  20pF  [C0603]  26.79 20.41 90 top
C3  10pF  [C0603]  20.82 13.3 0 top
C4  10pF  [C0603]  20.19 16.09 90 top
C5  1uF  [C0603]  45.33 21.94 90 top
C6  1uF  [C0603]  51.43 22.06 270 top
C7  100nF  [C0603]  77.97 33.49 270 top
C8  100nF  [C0603]  14.85 24.35 0 top
C9  100nF  [C0603]  30.35 21.81 180 top
C10  100nF  [C0603]  24.38 13.3 180 top
C11  100nF  [C0603]  33.52 14.44 45 top
C12  100nF  [C0603]  37.33 18 315 top
C13  100nF  [C0603]  25.01 16.09 90 top
D1  MBR0530  [SOD-123_L2.8-W1.8-LS3.7-RD]  53.97 22.32 270 top
D2  MBR0530  [SOD-123_L2.8-W1.8-LS3.7-RD]  56.26 22.32 270 top
D3  MBR0530  [SOD-123_L2.8-W1.8-LS3.7-RD]  6 44 0 top
I2C1  PZ254V-11-04P  [HDR-TH_4P-P2.54-V-M]  12.5 15.97 270 top
I2C2  2.54-1*4P母  [HDR-TH_4P-P2.54-V-F]  16.5 15.97 270 top
J1  2.54-2*8P母  [HDR-TH_16P-P2.54-V-F-R2-C8-S2.54]  56.51 8.22 180 bottom
JPG  PZ254V-11-08P  [HDR-TH_8P-P2.54-V-M]  61.59 38.45 90 top
JPV  PZ254V-11-08P  [HDR-TH_8P-P2.54-V-M]  64.13 38.45 90 top
L1  CBG160808U000T  [L0603]  30.22 18.51 135 top
M0  PZ254V-11-04P  [HDR-TH_4P-P2.54-V-M]  12.46 44 270 top
M1  PZ254V-11-04P  [HDR-TH_4P-P2.54-V-M]  15 44 270 top
M2  PZ254V-11-04P  [HDR-TH_4P-P2.54-V-M]  12.48 33.84 270 top
M3  PZ254V-11-04P  [HDR-TH_4P-P2.54-V-M]  15 33.84 270 top
MCU  STM32F103C8T6  [LQFP-48_L7.0-W7.0-P0.50-LS9.0-BL]  33.14 16.73 45 bottom
P13  TJ-S1608SW6TGLC6B-A5  [LED0603-R-RD_BLUE]  45.59 16.35 180 top
POW  KT-0603R  [LED0603-RD]  49.53 16.35 0 top
R1  10kΩ  [R0603]  14.85 26.51 180 top
R2  10kΩ  [R0603]  78.23 14.06 90 top
R3  5.1kΩ  [R0603]  78.23 17.62 270 top
R7  4.7kΩ  [R0603]  45.59 18.51 180 top
R8  4.7kΩ  [R0603]  49.4 18.51 0 top
R10  5.1kΩ  [R0603]  70.48 36.29 270 top
R11  10kΩ  [R0603]  52.06 17.87 270 top
R12  4.7kΩ  [R1206]  9.39 24.98 90 top
R13  4.7kΩ  [R1206]  11.93 24.98 90 top
RST  TC-1101T-B-A-B  [KEY-TH_2P-L6.0-W3.5-P6.50]  6 8 0 top
Servo  PZ254V-11-08P  [HDR-TH_8P-P2.54-V-M]  66.67 38.45 90 top
SW  PZ254V-11-03P  [HDR-TH_3P-P2.54-V-M]  66.8 18.89 270 top
U2  CH340N  [SOP-8_L4.9-W3.9-P1.27-LS6.0-BL]  76.83 26 180 bottom
U3  TLV75733PDBVR  [SOT-23-5_L2.9-W1.6-P0.95-LS2.8-BL]  48.25 22.57 180 top
U6  MCP1416T-E/OT  [SOT-23-5_L3.0-W1.7-P0.95-LS2.8-BL]  10.92 -4.35 0 top
USB1  HC-TYPE-C-16P-01A  [USB-C-SMD_HC-TYPE-C-16P-01A]  74.93 26 90 top
VOUT  2.54-1*4P母  [HDR-TH_4P-P2.54-V-F]  60.32 16.35 0 bottom
Y1  8MHz  [CRYSTAL-SMD_4P-L3.2-W2.5-BL]  23.49 20.41 0 top
Y2  32.768kHz  [FC-135R_L3.2-W1.5]  22.6 16.22 90 top

## Footprints (pads in the part's own frame, mm; a bottom-side part is the same pattern mirrored in y, then rotated)
C0603
  rect 0.8x0.9 smd: 1(-0.7,0) 2(0.7,0)
CRYSTAL-SMD_4P-L3.2-W2.5-BL
  rect 1.4x1.2 smd: 1(-1.1,-0.85) 2(1.1,-0.85) 3(1.1,0.85) 4(-1.1,0.85)
FC-135R_L3.2-W1.5
  rect 1x1.8 smd: 1(-1.25,0) 2(1.25,0)
HDR-TH_2P-P2.54-V-M
  rect 2x2 hole 1.2: 1(-1.27,0)
  round 2 hole 1.2: 2(1.27,0)
HDR-TH_2P-P2.54-V-M-1
  rect 1.8x1.8 hole 1: 1(-1.27,0)
  round 1.8 hole 1: 2(1.27,0)
HDR-TH_3P-P2.54-V-M
  rect 1.7x1.7 hole 1.1: 1(-2.54,0)
  round 1.7 hole 1.1: 2(0,0) 3(2.54,0)
HDR-TH_4P-P2.54-V-F
  rect 1.7x1.7 hole 1.1: 1(-3.81,0)
  round 1.7 hole 1.1: 2(-1.27,0) 3(1.27,0) 4(3.81,0)
HDR-TH_4P-P2.54-V-M
  rect 1.7x1.7 hole 1.1: 1(-3.81,0)
  round 1.7 hole 1.1: 2(-1.27,0) 3(1.27,0) 4(3.81,0)
HDR-TH_8P-P2.54-V-M
  rect 1.5x1.5 hole 1: 1(-8.89,0)
  round 1.5 hole 1: 2(-6.35,0) 3(-3.81,0) 4(-1.27,0) 5(1.27,0) 6(3.81,0) 7(6.35,0) 8(8.89,0)
HDR-TH_16P-P2.54-V-F-R2-C8-S2.54
  rect 1.8x1.8 hole 1: 1(-8.89,-1.27)
  round 1.8 hole 1: 2(-8.89,1.27) 3(-6.35,-1.27) 4(-6.35,1.27) 5(-3.81,-1.27) 6(-3.81,1.27) 7(-1.27,-1.27) 8(-1.27,1.27) 9(1.27,-1.27) 10(1.27,1.27) 11(3.81,-1.27) 12(3.81,1.27) 13(6.35,-1.27) 14(6.35,1.27) 15(8.89,-1.27) 16(8.89,1.27)
KEY-TH_2P-L6.0-W3.5-P6.50
  round 2 hole 1.3: 1(-3.25,0) 2(3.25,0)
L0603
  rect 0.8x0.864 smd: 1(-0.7,0) 2(0.7,0)
LED0603-R-RD_BLUE
  rect 0.8x0.8 smd: 1(0.851,0) 2(-0.851,0)
LED0603-RD
  rect 0.8x0.8 smd: 1(-0.799,0) 2(0.799,0)
LQFP-48_L7.0-W7.0-P0.50-LS9.0-BL
  oval 0.27x1.5 smd: 1(-2.75,-4.25) 2(-2.25,-4.25) 3(-1.75,-4.25) 4(-1.25,-4.25) 5(-0.75,-4.25) 6(-0.25,-4.25) 7(0.25,-4.25) 8(0.75,-4.25) 9(1.25,-4.25) 10(1.75,-4.25) 11(2.25,-4.25) 12(2.75,-4.25) 25(2.75,4.25) 26(2.25,4.25) 27(1.75,4.25) 28(1.25,4.25) 29(0.75,4.25) 30(0.25,4.25) 31(-0.25,4.25) 32(-0.75,4.25) 33(-1.25,4.25) 34(-1.75,4.25) 35(-2.25,4.25) 36(-2.75,4.25)
  oval 1.5x0.27 smd: 13(4.25,-2.75) 14(4.25,-2.25) 15(4.25,-1.75) 16(4.25,-1.25) 17(4.25,-0.75) 18(4.25,-0.25) 19(4.25,0.25) 20(4.25,0.75) 21(4.25,1.25) 22(4.25,1.75) 23(4.25,2.25) 24(4.25,2.75) 37(-4.25,2.75) 38(-4.25,2.25) 39(-4.25,1.75) 40(-4.25,1.25) 41(-4.25,0.75) 42(-4.25,0.25) 43(-4.25,-0.25) 44(-4.25,-0.75) 45(-4.25,-1.25) 46(-4.25,-1.75) 47(-4.25,-2.25) 48(-4.25,-2.75)
R0603
  rect 0.806x0.864 smd: 1(-0.753,0) 2(0.753,0)
R1206
  rect 1.208x1.701 smd: 1(-1.479,0) 2(1.479,0)
SOD-123_L2.8-W1.8-LS3.7-RD
  rect 0.95x1.15 smd: 1(-1.692,0) 2(1.692,0)
SOP-8_L4.9-W3.9-P1.27-LS6.0-BL
  oval 0.63x1.865 smd: 1(-1.905,-2.683) 2(-0.635,-2.683) 3(0.635,-2.683) 4(1.905,-2.683) 5(1.905,2.683) 6(0.635,2.683) 7(-0.635,2.683) 8(-1.905,2.683)
SOT-23-5_L2.9-W1.6-P0.95-LS2.8-BL
  rect 0.6x1 smd: 1(-0.95,-1.1) 2(0,-1.1) 3(0.95,-1.1) 4(0.95,1.1) 5(-0.95,1.1)
SOT-23-5_L3.0-W1.7-P0.95-LS2.8-BL
  rect 0.49x1.157 smd: 1(-0.95,-1.153) 2(0,-1.153) 3(0.95,-1.153)
  rect 0.49x1.175 smd: 4(0.95,1.153) 5(-0.95,1.153)
USB-C-SMD_HC-TYPE-C-16P-01A
  oval 1x2.1 hole 0.6x1.7: 1(-4.32,1.77) 2(4.32,1.77)
  oval 1x1.6 hole 0.6x1.2: 3(4.32,-2.41) 4(-4.32,-2.41)
  rect 0.6x1.3 smd: A1B12(-3.2,2.41) A4B9(-2.4,2.41) B1A12(3.2,2.41) B4A9(2.4,2.41)
  rect 0.3x1.3 smd: A5(-1.25,2.41) A6(-0.25,2.41) A7(0.25,2.41) A8(1.25,2.41) B5(1.75,2.41) B6(0.75,2.41) B7(-0.75,2.41) B8(-1.75,2.41)

## Nets
As in the schematic.

Pads without a net: J1 4 6 12 14; U2 4; U3 4; U6 1 2 3 4 5; USB1 A8 B8

## Via types
v1: diameter 0.61, hole 0.305, Top Layer to Bottom Layer, 51 vias

## Routing (per net, layer and track width the routed paths; a pad name or vN(x,y) marks a point on that pad's centre or on a via; arc(x,y) is an arc through that point)
3V3: length 164.9
  Top Layer w0.254: 9.09,26.51 v1(14.1,26.51) ; L1.1 32.38,16.35 32.38,14.57 33.16,13.8 33.16,13.69 ; P13.1 44.74,14.81 45.61,13.94 ; SW.3 67.7,16.35 76.05,8 BT0.2
  Top Layer w0.3: I2C1.3 I2C2.3 18.79,12.41 18.79,11.39 19.55,10.63 23.87,10.63 25.08,11.84 v1(25.08,13.3) 26,13.3 L1.1 31.71,19 31.71,19.98 32.14,20.41 33.27,20.41 36.66,17.02 37.31,17.02 37.8,17.5 C12.2 ; 37.7,17.38 37.94,17.62 v1(39.87,17.62) 41.11,16.38 41.11,15.11 42.29,13.94 43.6,13.94 ; 42.92,13.94 49.15,13.94 50.32,15.11 POW.2
  Top Layer w0.4: U3.5 51.32,21.47 v1(51.43,21.36)
  Bottom Layer w0.254: 16.67,22.32 13.71,22.32 12.57,23.46 12.57,25.87 13.2,26.51 v1(14.1,26.51) ; 16.67,22.32 18.5,20.48 18.52,20.48 ; 16.67,22.32 18.52,20.48 ; I2C2.3 17.81,14.7 18.52,15.41 18.52,20.48 ; v1(25.08,13.3) 25.08,13.62 27.43,15.97 27.89,15.97 MCU.48 ; v1(33.03,13.95) 33.03,12.95 MCU.36 ; MCU.24 38.56,18.25 39.49,18.25 39.87,17.87 v1(39.87,17.62) ; SW.3 67.94,16.35 69.21,17.62 69.21,24.35 72.38,27.52 73.77,27.52 U2.5 74.93,29.94 76.83,31.84 77.59,31.84 77.97,32.22 v1(77.97,32.79) 78.74,32.03 U2.8
  Bottom Layer w0.3: POW.2 51.43,15.24 52.99,15.24 53.97,16.22 53.97,18.7 53.49,19.18
  Bottom Layer w0.6: v1(51.43,21.36) 53.91,18.76 64.38,18.76 SW.3
  vias: v1(50.32,16.35)
GND: length 404
  Top Layer w0.254: v1(20.12,13.3) 19.43,13.3 18.52,14.21 18.52,20.8 18.81,21.09 20.17,21.09 C1.1 22.24,21.11 Y1.4 22.39,21.98 22.6,22.19 27.78,22.19 28.28,21.69 28.28,20.12 27.69,19.52 26.79,19.52 26.66,19.65 ; 20.12,13.68 20.12,12.6 20.7,12.03 22.92,12.03 23.68,12.79 v1(23.68,13.3) ; 20.19,15.65 20.19,13.62 20.12,13.55 ; Y1.2 25.01,19.14 C13.2 ; 24.63,19.52 26.48,19.52 C2.1 ; C9.1 33.14,21.81 36.46,18.49 C12.1 ; 36.71,18.37 37.23,18.89 v1(40,18.89) ; v1(45.33,21.24) 45.33,20.92 46.04,20.21 49.28,20.21 50.19,19.3 50.19,18.76 ; 48.25,23.67 48.32,23.61 48.32,20.21 ; 50.15,18.76 51.81,18.76 51.94,18.63 ; C6.1 52.38,22.76 52.7,22.44 52.7,19.3 52.06,18.67 ; 69.21,33.55 69.21,34.26 R10.2 ; 69.21,44.31 70.59,45.69 75.05,45.69 76.07,44.67 ADDR..2 ; 77.66,21.68 77.87,21.68 79.32,20.23 79.32,17.57 78.57,16.82 78.23,16.82 ; 77.97,21.68 USB1.4 ; R3.2 R2.2
  Top Layer w0.4: 45.27,21.24 44.94,21.24 42.78,23.39 42.78,25.1 43.68,26 61.43,26 61.72,26.29 ; 61.08,25.36 61.08,25.49 60.57,26 61.22,26.65 61.29,26.65 ; USB1.2 72.51,29.68 USB1.B1A12 ; USB1.A1B12 72.51,22.32 USB1.1
  Top Layer w0.5: I2C1.4 I2C2.4 19.04,9.62 20.37,9.62 ; 19.29,9.62 44.83,9.62 45.84,8.6 45.84,5.43 47.24,4.03 70.86,4.03 73.66,6.82 73.66,8.6 71.62,10.63 ; VOUT.2 59.05,14.92 60.42,13.55 68.26,13.55 71.14,10.63 71.62,10.63 ; 71.62,10.63 71.4,10.63
  Top Layer w0.6: 5Vout.2 1.77,22.14 1.77,12.55 6.32,8 RST.2 ; JPG.8 61.59,48.61 62.86,49.88 67.56,49.88 69.21,48.22 69.21,32.83 71.59,30.32 73.15,30.32
  Top Layer w1.6: VOUT.2 59.05,21.56 61.72,24.22 61.72,29.68 61.59,29.81 ; JPG.1 JPG.8
  Bottom Layer w0.254: v1(14.15,24.35) 16.95,24.35 C1.1 ; v1(23.68,13.3) 23.68,12.6 24.38,11.9 25.83,11.9 26.28,12.35 26.28,13.7 26.92,14.35 27.58,14.35 28.55,15.31 ; MCU.8 31.99,18.95 32.44,18.49 35.19,18.49 35.7,17.98 ; 33.72,13.37 34.02,13.67 ; 33.72,13.37 33.72,12.97 MCU.35 ; 33.72,13.37 34.02,13.67 ; 34.02,13.67 v1(34.02,14.94) 34.94,15.86 35.45,15.86 36.39,16.79 36.39,16.79 MCU.23 38.48,18.89 v1(40,18.89) ; 35.66,18.02 36.4,17.28 36.4,16.79 ; U2.3 76.19,22.02 76.53,21.68 USB1.4 ; ADDR..2 77.97,41.75 v1(77.97,34.19)
  Bottom Layer w0.4: I2C2.4 18.98,12.16 v1(20.12,13.3) ; v1(40,18.89) 40.76,19.65 40.76,20.21 42.36,21.81 44.76,21.81 v1(45.33,21.24)
  Bottom Layer w0.5: 4.65,24.87 3.15,24.87 1.52,26.51 1.52,40.22 4.69,43.4 9.25,43.4 M0.4 16.48,40.19 17.84,38.83 17.84,30.89 17.01,30.06 12.51,30.06 M2.4
  Bottom Layer w0.6: 9.25,7.52 9.25,10.24 11.17,12.16 I2C1.4
  vias: v1(20.19,21.09)
VBAT: length 3.9
  Bottom Layer w0.254: v1(25.14,15.65) 26.05,15.65 MCU.1
VCC_USB: length 46.5
  Top Layer w0.254: 69.72,27.53 70.59,28.4 USB1.B4A9
  Top Layer w0.4: D1.2 53.97,15.2 54.73,14.44 58.31,14.44 59.96,12.79 67.69,12.79 v1(68.32,12.16) ; 71.23,23.6 69.72,25.11 69.72,27.55 70.57,28.4 72.58,28.4 ; 71.23,23.6 71.23,17.25 v1(71.75,16.86) ; 71.23,23.6 72.58,23.6
  Bottom Layer w0.4: 68.45,12.03 71.75,15.33 v1(71.75,16.86)
VDDA: length 5.2
  Top Layer w0.254: L1.2 29.01,19.72 29.01,21.17 v1(29.65,21.81)
  Bottom Layer w0.254: v1(29.65,21.81) 29.83,21.81 MCU.9
BOOT0: length 60.3
  Top Layer w0.254: v1(32.76,17.24) 33.52,17.24 37.84,12.92 57.49,12.92 59.14,11.27 66.08,11.27 67.43,9.92 67.43,8.47 67.91,8 69.67,8 ; 70.19,8 BT0.1 69.35,8
  Bottom Layer w0.254: MCU.44 30.42,15.07 32.39,15.07 33.4,16.07 33.4,16.47 32.76,17.11 v1(32.76,17.24) ; BT0.1 72.75,10 76.96,10 78.23,11.27 78.23,13.27
  vias: v1(78.23,13.31)
D+: length 12.4
  Top Layer w0.254: 72.58,25.75 70.92,25.75 70.73,25.94 70.73,26.51 70.98,26.75 USB1.B6 ; 72.58,26.78 75.16,26.78 76.83,25.11 77.72,25.11 78.74,24.09 v1(78.74,23.32)
D-: length 12.5
  Top Layer w0.254: USB1.A7 74.29,26.25 76.04,24.5 76.83,24.5 ; 73.99,25.25 72.58,25.25 75.22,25.25 75.96,24.5 76.83,24.5 ; 76.83,24.5 77.47,23.87 v1(77.47,23.32)
NRST: length 100.3
  Top Layer w0.254: v1(15.61,26.51) 15.61,24.4 C8.2
  Bottom Layer w0.254: RST.1 2.75,22.02 0.76,24.01 0.76,40.99 5.2,45.43 6.6,45.43 8.5,47.34 8.5,48.1 10.41,50 16.76,50 19.3,47.46 19.3,26.03 20.6,24.73 ; 15.65,26.51 18.08,26.51 19.3,27.73 ; 16.98,26.51 v1(15.61,26.51) ; 20.57,24.73 25.49,24.73 30.31,19.91
OSC32_IN: length 11.5
  Top Layer w0.254: 21.52,13.55 22.6,14.63 v1(22.6,14.97) 22.73,15.1
  Bottom Layer w0.254: 22.62,15.03 24.12,16.5 24.12,18 25.65,19.52 27.87,19.52 MCU.3
OSC32_OUT: length 10.7
  Top Layer w0.254: 20.31,16.92 20.87,17.47 v1(22.6,17.47)
  Bottom Layer w0.254: v1(22.6,17.47) 25.16,20.03 28.07,20.03 MCU.4
OSC_IN: length 10.4
  Top Layer w0.254: C1.2 20.34,19.56 v1(22.39,19.56)
  Bottom Layer w0.254: v1(22.39,19.56) 23.38,20.51 28.3,20.51 MCU.5
OSC_OUT: length 6
  Top Layer w0.254: 26.94,21.26 Y1.3
  Bottom Layer w0.254: 27.05,21.24 28.28,21.24 MCU.6
  vias: v1(26.79,21.24)
PA4: length 65.2
  Top Layer w0.254: v1(33.12,19.49) 33.63,18.98 33.63,18.01 38.21,13.43 57.78,13.43 59.43,11.78 66.55,11.78 68.19,10.13 68.19,9.63 v1(68.7,9.12)
  Bottom Layer w0.254: 33.12,19.89 v1(33.12,19.49) ; 33.12,19.89 33.12,19.36 ; 33.12,19.89 34.53,21.3 ; 33.12,19.89 34.56,21.33 ; J1.9 58.8,3.39 66.67,3.39 68.7,5.43 v1(68.7,9.12)
PA5: length 33.7
  Top Layer w0.254: M3.2 15.9,35.11 17.27,33.75 17.27,25.36 18.41,24.22 33.52,24.22 ; 32.88,24.22 34.42,24.22 v1(35.3,23.33)
  Bottom Layer w0.254: MCU.15 35.81,21.87 35.81,22.83 v1(35.3,23.33)
PA8: length 49.9
  Top Layer w0.254: M3.3 16.76,30.81 16.76,24.98 18.03,23.71 33.52,23.71 34.79,22.44 36.73,22.44 37.62,21.56 40.25,21.56 40.76,21.05 40.76,17.75 43.43,15.07 v1(43.43,14.82)
  Bottom Layer w0.254: MCU.29 38.27,12.67 41.78,12.67 43.43,14.31 v1(43.43,14.82)
PA10: length 58.6
  Top Layer w0.254: v1(76.19,28.68) 76.19,27.16 77.1,26.25 v1(78.23,26.25)
  Bottom Layer w0.254: MCU.31 37.87,11.65 43.56,11.65 45.84,13.94 69.46,13.94 70.73,15.2 ; 70.73,15.2 70.23,14.7 ; 70.73,15.2 70.73,23.46 73.28,26 77.98,26 v1(78.23,26.25)
PB2: length 63.6
  Top Layer w0.254: 52.06,16.97 52.06,15.2 53.34,13.94 58,13.94 59.66,12.28 66.8,12.28 69.21,9.87 71.5,9.87 72.64,8.73 72.64,7.33 70.23,4.92 67.43,4.92 ; J1.7 57.78,5.81 58.67,4.92 67.56,4.92 67.69,5.04
  Bottom Layer w0.254: MCU.20 39.88,22.4 47.85,22.4 52.06,18.18 R11.2
  vias: v1(52.06,17.08)
PB5: length 29.3
  Top Layer w0.254: v1(27.68,11.27) 28.06,10.89 48.38,10.89 48.89,10.38 48.89,8.22 J1.15
  Bottom Layer w0.254: v1(27.68,11.27) 28.74,11.27 MCU.41
PB6: length 27.3
  Top Layer w0.254: v1(26.16,11.01) 26.92,10.25 46.86,10.25 J1.16
  Bottom Layer w0.254: v1(26.16,11.01) 27.17,12.03 28.8,12.03 MCU.42
PB7: length 31.4
  Top Layer w0.254: v1(28.19,12.79) 29.59,11.39 54.6,11.39 55.24,10.76 J1.10
  Bottom Layer w0.254: v1(28.19,12.79) 28.85,12.79 MCU.43
PB8: length 35.3
  Top Layer w0.254: v1(27.43,13.55) 27.95,14.08 28.81,14.08 30.98,11.9 56.38,11.9 57.78,10.51 J1.8
  Bottom Layer w0.254: v1(27.43,13.55) 28.2,13.55 MCU.45
PB9: length 44.9
  Top Layer w0.254: 31.26,15.97 30.61,15.97 30.03,15.39 30.03,14.13 31.75,12.41 57.15,12.41 59.05,10.51 59.05,8.73 59.56,8.22 64.13,8.22 J1.2
  Bottom Layer w0.254: MCU.46 29.91,15.97 31.26,15.97
  vias: v1(31.24,15.97)
PB10: length 47.1
  Top Layer w0.254: R13.1 11.93,22.59 12.2,22.32 ; I2C2.2 I2C1.2 10.95,17.24 10.41,17.78 10.41,21.49 11.24,22.32 15.87,22.32 16.76,23.21 ; 16.76,23.21 16.25,22.7 ; 16.76,23.21 33.27,23.21 34.6,21.87 36.43,21.87 37.51,20.79 v1(39.99,20.79)
  Bottom Layer w0.254: MCU.21 38.97,20.79 v1(39.99,20.79)
PB11: length 38.6
  Top Layer w0.254: I2C1.1 I2C2.1 16.5,21.4 17.38,22.28 ; 17.23,22.13 17.83,22.73 32.95,22.73 34.38,21.3 36.19,21.3 37.59,19.9 v1(39.6,19.9)
  Bottom Layer w0.254: v1(9.39,23.76) 12.5,20.27 I2C1.1 ; MCU.22 38.79,19.9 v1(39.6,19.9)
PB12: length 53.9
  Top Layer w0.254: M0.3 13.7,41.49 16.76,41.49 17.84,40.43 17.84,26.06 19.17,24.73 37.94,24.73 40.49,22.17 41.45,21.22 v1(41.45,19.29)
  Bottom Layer w0.254: MCU.25 38.09,15.69 38.99,16.59 40.08,16.59 40.92,17.43 40.92,18.76 v1(41.45,19.29)
PB13: length 61.9
  Top Layer w0.254: M0.2 13.7,44.03 13.97,44.03 ; 13.83,44 16.67,44 19.04,41.62 19.04,26.64 19.93,25.75 38.2,25.75 ; 37.37,25.75 38.22,25.75 42.36,21.61 ; 41.78,22.19 42.61,21.36 42.61,20.48 42.67,20.43 v1(42.67,20.28)
  Bottom Layer w0.254: 37.74,15.31 38.86,14.19 40.51,14.19 41.52,15.2 41.52,15.71 42.79,16.98 42.79,20.16
PB14: length 60.8
  Top Layer w0.254: M1.2 16.67,45.27 19.68,42.26 19.68,27.02 20.44,26.25 39.03,26.25 ; 38.8,26.25 39.07,26.25 43.43,21.89 43.43,20.94
  Bottom Layer w0.254: MCU.27 38.73,13.65 40.99,13.65 42.03,14.7 42.03,15.46 43.43,16.86 43.43,20.92 43.56,21.05
  vias: v1(43.43,21.05)
PB15: length 69.7
  Top Layer w0.254: M1.3 16.79,42.73 18.41,41.11 18.41,26.38 19.55,25.24 34.41,25.24 ; 34.27,25.24 38.09,25.24 41.91,21.43 41.91,19.95 42.54,19.27 43.56,19.27 44.06,19.78 ; 44.06,19.78 43.94,19.65 ; 44.06,19.78 47.24,19.78 47.49,19.52 47.49,17.11 47.62,16.98 v1(47.62,15.2)
  Bottom Layer w0.254: MCU.28 38.47,13.17 41.27,13.17 42.54,14.44 42.54,15.19 43.15,15.84 46.99,15.84 v1(47.62,15.2)
PC13: length 79.5
  Top Layer w0.254: v1(35.43,17.11) 37.13,15.41 v1(39.81,15.41) ; v1(42.14,18.51) v1(44.79,18.51)
  Bottom Layer w0.254: MCU.2 29.94,16.75 30.87,16.75 32.13,18 33.14,18 34.03,17.11 v1(35.43,17.11) ; 39.94,15.28 42.14,17.46 v1(42.14,18.51) ; v1(44.79,18.51) 44.79,18.16 45.41,17.54 50.34,17.54 52.17,15.71 52.7,15.71 53.34,16.35 53.34,17.62 50.26,20.69 50.26,21.82 50.79,22.34 ; 50.79,22.34 52.1,22.34 ; 50.79,22.34 60.98,22.34 62.35,23.71 67.81,23.71 71.62,27.52 71.62,42.51 72.77,43.65 ADDR..1
5VIN: length 161.4
  Top Layer w0.4: 9.65,20.07 9.65,10.89 10.54,10 15.81,10 16.96,8.86 44.57,8.86 45.21,8.22 45.21,5.17 47.37,3.01 70.86,3.01 74.42,6.57 74.42,8.86 71.75,11.52 71.5,11.52 68.7,14.32 62.22,14.32 61.59,14.95 61.59,16.34 ; 9.65,36.5 10.79,37.65 M3.1
  Top Layer w0.5: 9.65,20.07 7.23,22.48 7.23,28.79 9.65,31.21 9.65,45 M0.1 M1.1
  Top Layer w0.6: D3.2 8.48,44 9.65,42.83 ; 56.25,20.76 56.25,16.61 VOUT.1
  Top Layer w1.6: VOUT.3 61.59,19.52 63.5,21.43 SW.1
  Bottom Layer w0.254: VOUT.1 56.51,15.67 57.1,15.08 60.31,15.08 60.32,15.07 61.59,16.34 VOUT.3
PA0: length 42
  Bottom Layer w0.254: 32.89,26.25 30.22,23.59 30.22,22.12 MCU.10 ; 32.89,26.38 59.43,26.38 60.83,27.78 64.89,27.78 Servo.1
PA1: length 45.9
  Bottom Layer w0.254: 31.73,21.33 30.86,22.2 30.86,23.46 33.27,25.87 59.56,25.87 60.96,27.27 66.8,27.27 68.07,28.54 68.07,30.7 Servo.2
PA2: length 47.8
  Bottom Layer w0.254: MCU.12 32.08,23.92 33.52,25.36 59.69,25.36 61.08,26.76 66.92,26.76 68.57,28.41 68.57,32.98 66.92,34.64 Servo.3
PA3: length 50.3
  Bottom Layer w0.254: MCU.13 33.12,22.76 33.12,23.69 34.29,24.86 59.81,24.86 61.21,26.25 67.18,26.25 69.08,28.16 69.08,34.76 Servo.4
PA6: length 50.4
  Bottom Layer w0.254: MCU.16 38.99,24.35 59.94,24.35 61.34,25.75 67.31,25.75 69.59,28.03 69.59,36.92 66.8,39.72 Servo.5
PA7: length 53.4
  Bottom Layer w0.254: MCU.17 39.19,23.84 60.07,23.84 61.46,25.24 67.43,25.24 70.1,27.91 70.1,38.83 Servo.6
PA9: length 54.6
  Bottom Layer w0.254: MCU.30 38.07,12.16 43.43,12.16 45.72,14.44 69.34,14.44 70.23,15.33 70.23,23.9 73.11,26.78 77.08,26.78 77.47,27.16 U2.7
PA11: length 49.9
  Bottom Layer w0.254: 35.55,13.26 37.67,11.14 43.81,11.14 46.1,13.43 65.27,13.43 67.69,11.01 67.69,5.17 66.67,4.16 62.86,4.16 60.32,6.7 J1.5
PA12: length 46.4
  Bottom Layer w0.254: MCU.33 37.47,10.63 44.06,10.63 46.35,12.92 64.76,12.92 67.18,10.51 67.18,5.3 66.54,4.66 63.62,4.66 62.86,5.43 J1.3
PA13: length 36.2
  Bottom Layer w0.254: MCU.34 37.27,10.12 44.31,10.12 46.59,12.41 48.66,12.41 ; 48.74,12.41 60.69,12.41 61.59,11.52 61.59,8.73 62.1,8.22 64.13,8.22 J1.1
PA14: length 27.7
  Bottom Layer w0.254: MCU.37 31.49,11.19 31.49,10.51 32.38,9.62 44.7,9.62 46.99,11.9 50.16,11.9 51.43,10.63 51.43,7.97 52.45,6.95 J1.11
PA15: length 23.1
  Bottom Layer w0.254: MCU.38 30.61,11.01 30.6,11.01 30.6,10.51 32,9.11 44.86,9.11 45.75,8.22 48.89,8.22 J1.13
PB0: length 56.5
  Bottom Layer w0.254: 35.97,19.91 39.39,23.33 60.32,23.33 61.72,24.73 67.56,24.73 70.61,27.78 70.61,40.86 Servo.7
PB1: length 59.7
  Bottom Layer w0.254: MCU.19 39.62,22.85 60.73,22.85 62.1,24.22 67.69,24.22 71.12,27.65 71.12,42.89 Servo.8
PB3: length 50.4
  Bottom Layer w0.254: 9.9,19.9 7.23,22.57 7.23,27.93 9.65,30.35 9.65,32.28 M2.2 ; 9.9,19.9 9.9,18.96 ; 9.9,19.9 9.9,15.2 11.68,13.43 13.84,13.43 14.54,12.72 14.54,11.27 16.7,9.11 28,9.11 MCU.39
PB4: length 46.1
  Bottom Layer w0.254: 10.41,19.52 10.41,20.25 7.93,22.73 7.93,28.02 M2.3 ; 10.41,20 10.41,16.73 11.17,15.97 13.97,15.97 15.23,14.7 15.23,11.22 16.71,9.74 27.92,9.74 MCU.40
$1N3000: length 14.4
  Top Layer w0.254: 45.33,22.89 46.24,23.8 47.25,23.8
  Top Layer w0.3: 47.24,23.86 47.24,24.62 47.62,25 49.56,25
  Top Layer w0.5: 49.21,23.67 49.21,24.76 49.55,25.11 53.08,25.11 53.97,24.22 D1.1 D2.1
$1N4992: length 2.4
  Top Layer w0.254: 48.64,18.76 48.64,16.43 POW.1
$1N5076: length 2.4
  Top Layer w0.254: 46.38,18.76 46.38,16.4 P13.2
$1N6359: length 31.1
  Top Layer w0.254: 70.48,37.18 70.61,37.3 70.61,40.29 72.19,41.88 76.58,41.88 78.22,40.23 78.22,37.31 ; 72.58,27.75 74.7,27.75 75.22,28.27 75.22,30.35 76.26,31.39 78.74,31.39 79.24,31.89 79.24,35.78 78.22,36.8 78.22,37.93
$1N6363: length 10.2
  Top Layer w0.254: 72.58,24.75 73.76,24.75 74.67,23.84 75.26,23.84 75.96,23.13 75.96,21.02 76.58,20.41 77.37,20.41 78.23,19.56 R3.1
$1N11196: length 34.4
  Top Layer w1.6: JPV.8 JPV.1 64.13,26.79 65.68,25.24 67.69,25.24 69.84,23.08 69.84,19.9 68.83,18.89 SW.2
$1N25739: length 19.2
  Top Layer w0.4: 5Vout.1 4.06,27.27 1.77,29.56 1.77,41.47 D3.1

Small or netless copper shapes (teardrops, artwork), in the pictures only: 1 on Top Layer

## Text on the board
Bottom Silkscreen Layer: B1 | B0 | A7 | A6 | A3 | A2 | A1 | A0 | (MSDriver Kit V2.2) | B4 | B3 | A5 | A8 | B13 | B12 | B14 | B15 | B11 | B10 | JLCJLCJLCJLC | I2C ADDR: 0x32
Top Silkscreen Layer: SDA | SCK | 3.3V | GND | servo | (MCU) | 5V | 2 | 3 | 4 | 5 | 6 | 7 | 1 | 0 | ( 3.3V1A) | B6 | B5 | A15 | A14 | A4 | B7 | B8 | B2 | G | A11 | A12 | B9 | A13 | 3.3 | Vin: 6~24V | A | B | G V S | motor: | V=Vin, | I=2A(  ) | 5V3A | - + | 每 | 含 | 输出:
